# EAGLE design bottom20 (EAGLE 9.5.2)
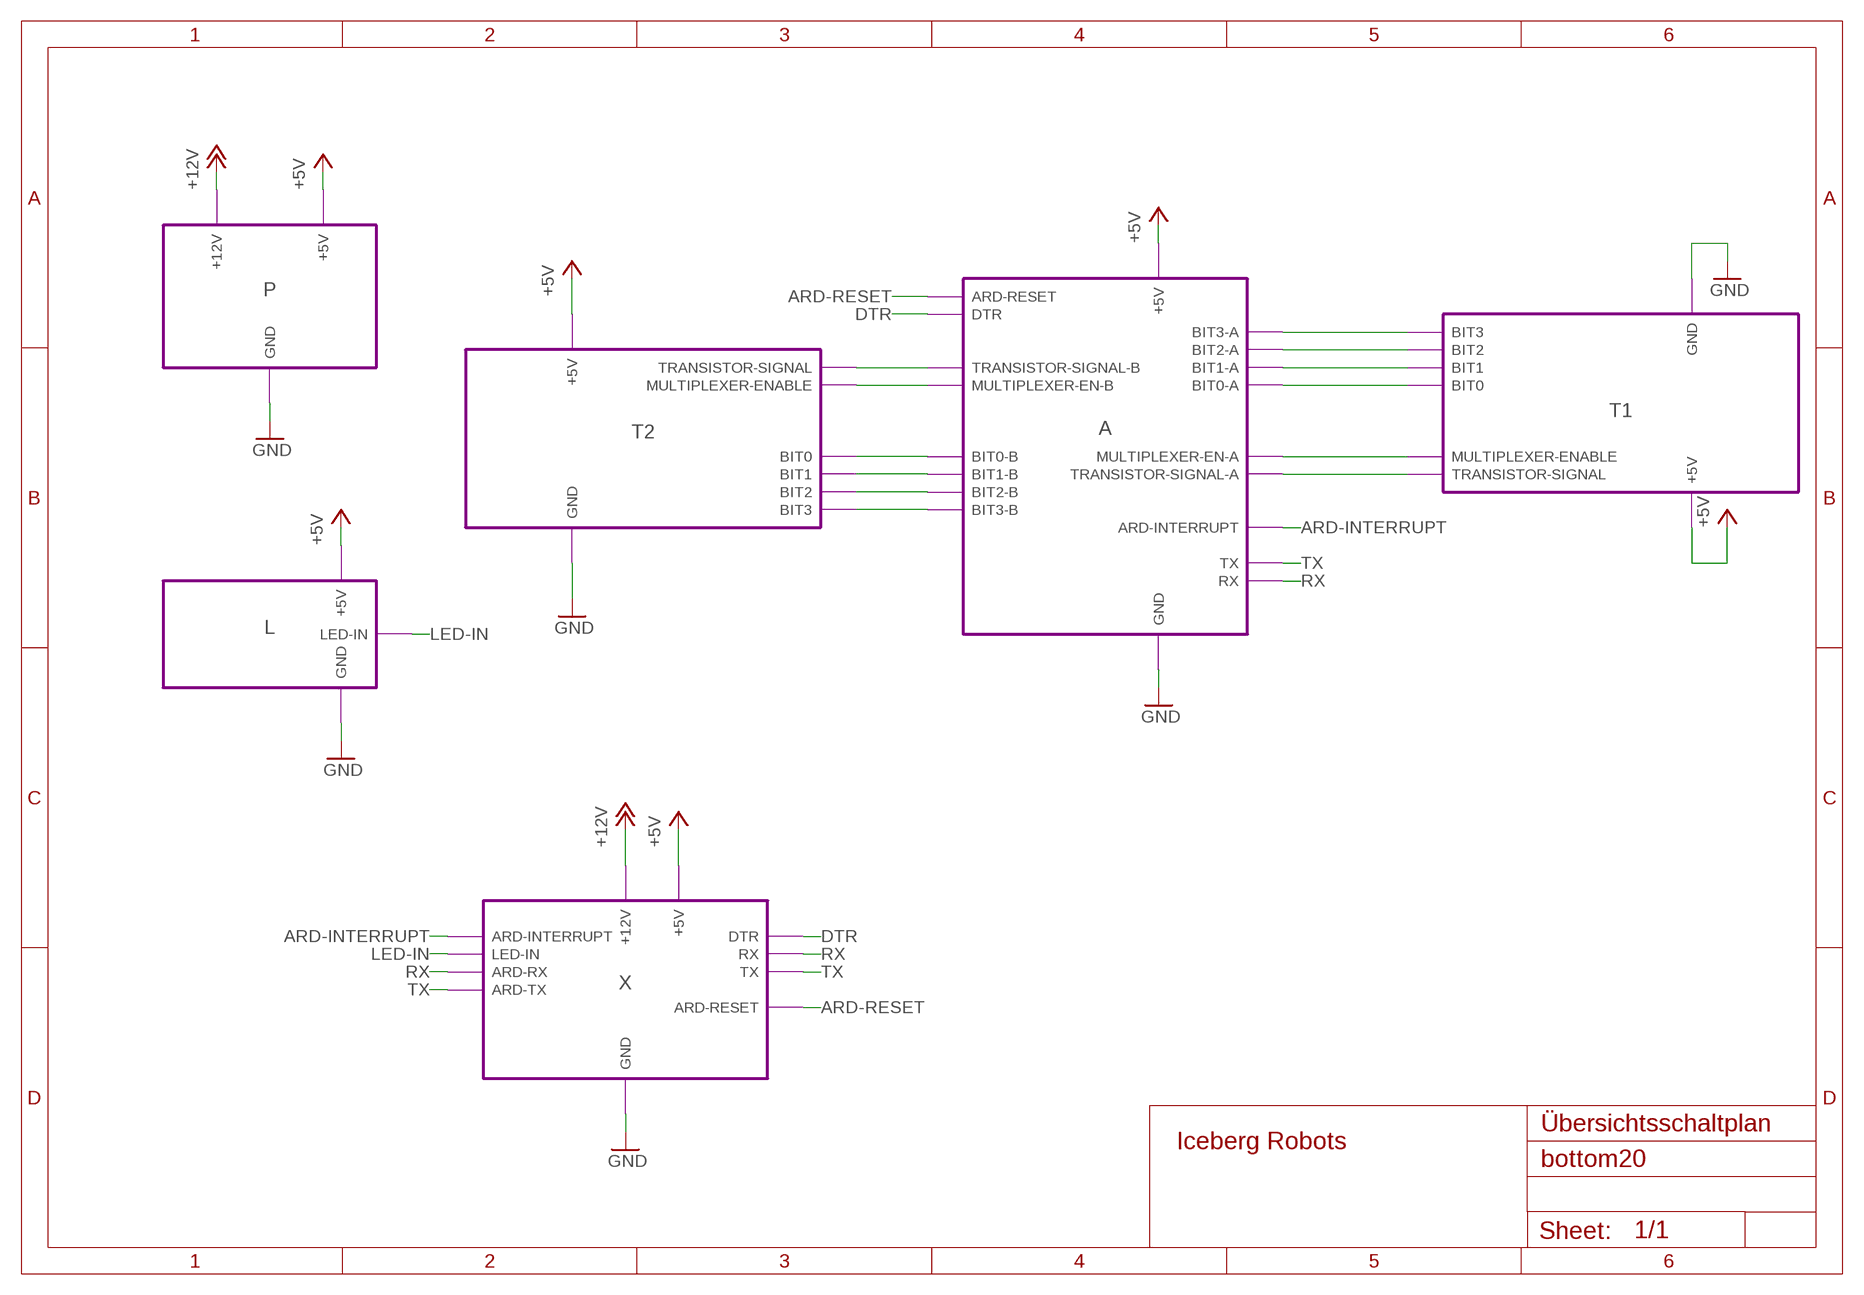
[diagram p0: schematic, sheet 1]

## Module instances
L = LED
X = ANSCHLUSS
A = ARDUINO
P = SCHALTREGLER
T1 = PHOTOTRANSISTOR
T2 = PHOTOTRANSISTOR

## Nets
+5V: port L.+5V T2.+5V T1.+5V A.+5V P.+5V X.+5V
+12V: port P.+12V X.+12V
ARD-INTERRUPT: port A.ARD-INTERRUPT X.ARD-INTERRUPT
ARD-RESET: port A.ARD-RESET X.ARD-RESET
DTR: port A.DTR X.DTR
GND: port L.GND X.GND A.GND P.GND T2.GND T1.GND
LED-IN: port X.LED-IN L.LED-IN
N$2: port T2.TRANSISTOR-SIGNAL A.TRANSISTOR-SIGNAL-B
N$3: port T2.MULTIPLEXER-ENABLE A.MULTIPLEXER-EN-B
N$4: port A.BIT0-B T2.BIT0
N$5: port A.BIT1-B T2.BIT1
N$6: port A.BIT2-B T2.BIT2
N$7: port A.BIT3-B T2.BIT3
N$8: port A.BIT3-A T1.BIT3
N$9: port A.BIT2-A T1.BIT2
N$10: port A.BIT1-A T1.BIT1
N$11: port A.BIT0-A T1.BIT0
N$12: port A.MULTIPLEXER-EN-A T1.MULTIPLEXER-ENABLE
N$13: port A.TRANSISTOR-SIGNAL-A T1.TRANSISTOR-SIGNAL
RX: port X.RX A.RX X.ARD-RX
TX: port X.TX A.TX X.ARD-TX

## Notes on the sheet
- Übersichtsschaltplan

## Library data of the parts

## Module LED
Ports: +5V(pwr) GND(pwr) LED-IN(in)
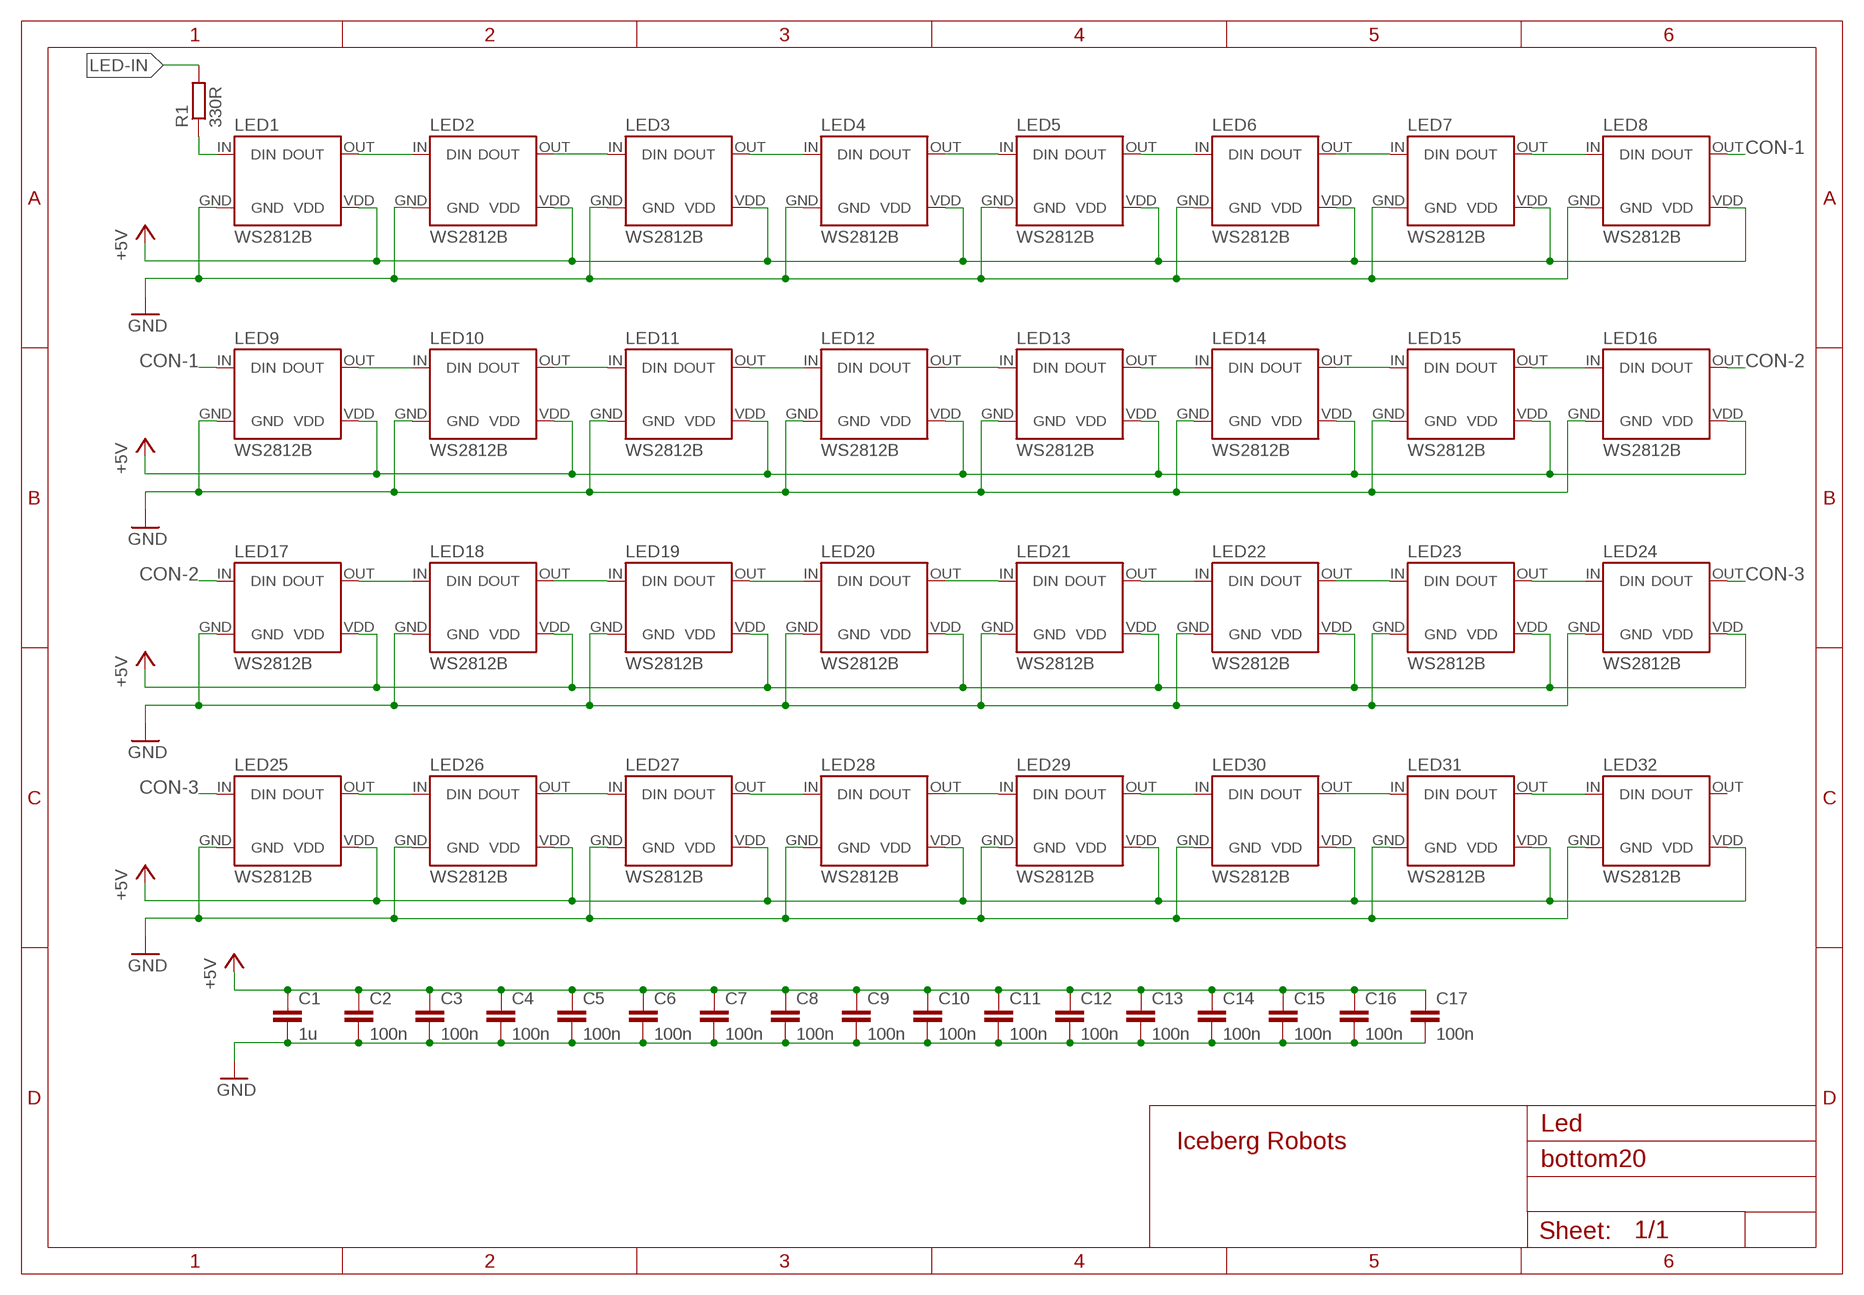
[diagram p1: schematic, module LED, sheet 1]

### Parts
C1  1u  C0805  [C0805]
C2  100n  C0805  [C0805]
C3  100n  C0805  [C0805]
C4  100n  C0805  [C0805]
C5  100n  C0805  [C0805]
C6  100n  C0805  [C0805]
C7  100n  C0805  [C0805]
C8  100n  C0805  [C0805]
C9  100n  C0805  [C0805]
C10  100n  C0805  [C0805]
C11  100n  C0805  [C0805]
C12  100n  C0805  [C0805]
C13  100n  C0805  [C0805]
C14  100n  C0805  [C0805]
C15  100n  C0805  [C0805]
C16  100n  C0805  [C0805]
C17  100n  C0805  [C0805]
LED1  WS2812B  [5050]
LED2  WS2812B  [5050]
LED3  WS2812B  [5050]
LED4  WS2812B  [5050]
LED5  WS2812B  [5050]
LED6  WS2812B  [5050]
LED7  WS2812B  [5050]
LED8  WS2812B  [5050]
LED9  WS2812B  [5050]
LED10  WS2812B  [5050]
LED11  WS2812B  [5050]
LED12  WS2812B  [5050]
LED13  WS2812B  [5050]
LED14  WS2812B  [5050]
LED15  WS2812B  [5050]
LED16  WS2812B  [5050]
LED17  WS2812B  [5050]
LED18  WS2812B  [5050]
LED19  WS2812B  [5050]
LED20  WS2812B  [5050]
LED21  WS2812B  [5050]
LED22  WS2812B  [5050]
LED23  WS2812B  [5050]
LED24  WS2812B  [5050]
LED25  WS2812B  [5050]
LED26  WS2812B  [5050]
LED27  WS2812B  [5050]
LED28  WS2812B  [5050]
LED29  WS2812B  [5050]
LED30  WS2812B  [5050]
LED31  WS2812B  [5050]
LED32  WS2812B  [5050]
R1  330R  R  [R0805]

### Nets
+5V: C1.1 C2.1 C3.1 C4.1 C5.1 C6.1 C7.1 C8.1 C9.1 C10.1 C11.1 C12.1 C13.1 C14.1 C15.1 C16.1 C17.1 LED1.VDD LED2.VDD LED3.VDD LED4.VDD LED5.VDD LED6.VDD LED7.VDD LED8.VDD LED9.VDD LED10.VDD LED11.VDD LED12.VDD LED13.VDD LED14.VDD LED15.VDD LED16.VDD LED17.VDD LED18.VDD LED19.VDD LED20.VDD LED21.VDD LED22.VDD LED23.VDD LED24.VDD LED25.VDD LED26.VDD LED27.VDD LED28.VDD LED29.VDD LED30.VDD LED31.VDD LED32.VDD
CON-1: LED8.OUT(DOUT) LED9.IN(DIN)
CON-2: LED16.OUT(DOUT) LED17.IN(DIN)
CON-3: LED24.OUT(DOUT) LED25.IN(DIN)
GND: C1.2 C2.2 C3.2 C4.2 C5.2 C6.2 C7.2 C8.2 C9.2 C10.2 C11.2 C12.2 C13.2 C14.2 C15.2 C16.2 C17.2 LED1.GND LED2.GND LED3.GND LED4.GND LED5.GND LED6.GND LED7.GND LED8.GND LED9.GND LED10.GND LED11.GND LED12.GND LED13.GND LED14.GND LED15.GND LED16.GND LED17.GND LED18.GND LED19.GND LED20.GND LED21.GND LED22.GND LED23.GND LED24.GND LED25.GND LED26.GND LED27.GND LED28.GND LED29.GND LED30.GND LED31.GND LED32.GND
LED-IN: R1.2
LED-IN1: LED2.OUT(DOUT) LED3.IN(DIN)
LED-IN2: LED4.OUT(DOUT) LED5.IN(DIN)
LED-IN3: LED6.OUT(DOUT) LED7.IN(DIN)
LED-IN4: LED26.OUT(DOUT) LED27.IN(DIN)
LED-IN5: LED10.OUT(DOUT) LED11.IN(DIN)
LED-IN6: LED12.OUT(DOUT) LED13.IN(DIN)
LED-IN7: LED14.OUT(DOUT) LED15.IN(DIN)
LED-IN8: LED28.OUT(DOUT) LED29.IN(DIN)
LED-IN9: LED18.OUT(DOUT) LED19.IN(DIN)
LED-IN10: LED20.OUT(DOUT) LED21.IN(DIN)
LED-IN11: LED22.OUT(DOUT) LED23.IN(DIN)
LED-IN12: LED30.OUT(DOUT) LED31.IN(DIN)
N$1: LED3.OUT(DOUT) LED4.IN(DIN)
N$2: LED1.OUT(DOUT) LED2.IN(DIN)
N$3: LED25.OUT(DOUT) LED26.IN(DIN)
N$4: LED5.OUT(DOUT) LED6.IN(DIN)
N$5: LED27.OUT(DOUT) LED28.IN(DIN)
N$6: LED29.OUT(DOUT) LED30.IN(DIN)
N$7: LED7.OUT(DOUT) LED8.IN(DIN)
N$8: LED31.OUT(DOUT) LED32.IN(DIN)
N$9: LED9.OUT(DOUT) LED10.IN(DIN)
N$10: LED1.IN(DIN) R1.1
N$11: LED11.OUT(DOUT) LED12.IN(DIN)
N$12: LED13.OUT(DOUT) LED14.IN(DIN)
N$13: LED15.OUT(DOUT) LED16.IN(DIN)
N$14: LED17.OUT(DOUT) LED18.IN(DIN)
N$16: LED19.OUT(DOUT) LED20.IN(DIN)
N$17: LED21.OUT(DOUT) LED22.IN(DIN)
N$18: LED23.OUT(DOUT) LED24.IN(DIN)
Unconnected: LED32.OUT(DOUT)

### Notes on the sheet
- Led

### Library data of the parts
C1-C17 = iceberg20:C: Capacitor, SMD 0805, Value wird festgelegt; BESTAND: -; HERSTELLER: -; HERSTELLER-NR: -; SUPPLIER: -; SUPPLIER-NR: -; TOLERANZ: 10%; V-MAX: 20V
LED1-LED32 = iceberg20:WS2812B: SMD RGB LED Datenblatt: Link <https://cdn-shop.adafruit.com/datasheets/WS2812B.pdf>; BESTAND: ?; HERSTELLER: SparkFun Electronics; HERSTELLER-NR: COM-13667; SUPPLIER: Mouser; SUPPLIER-NR: 474-COM-13667
R1 = iceberg20:R: Resistor, SMD 0805, Value wird festgelegt; BESTAND: -; HERSTELLER: -; HERSTELLER-NR: -; SUPPLIER: -; SUPPLIER-NR: -; TOLERANZ: 5%

## Module PHOTOTRANSISTOR
Ports: +5V(pwr) GND(pwr) MULTIPLEXER-ENABLE(in) TRANSISTOR-SIGNAL(out) BIT0(in) BIT1(in) BIT2(in) BIT3(in)
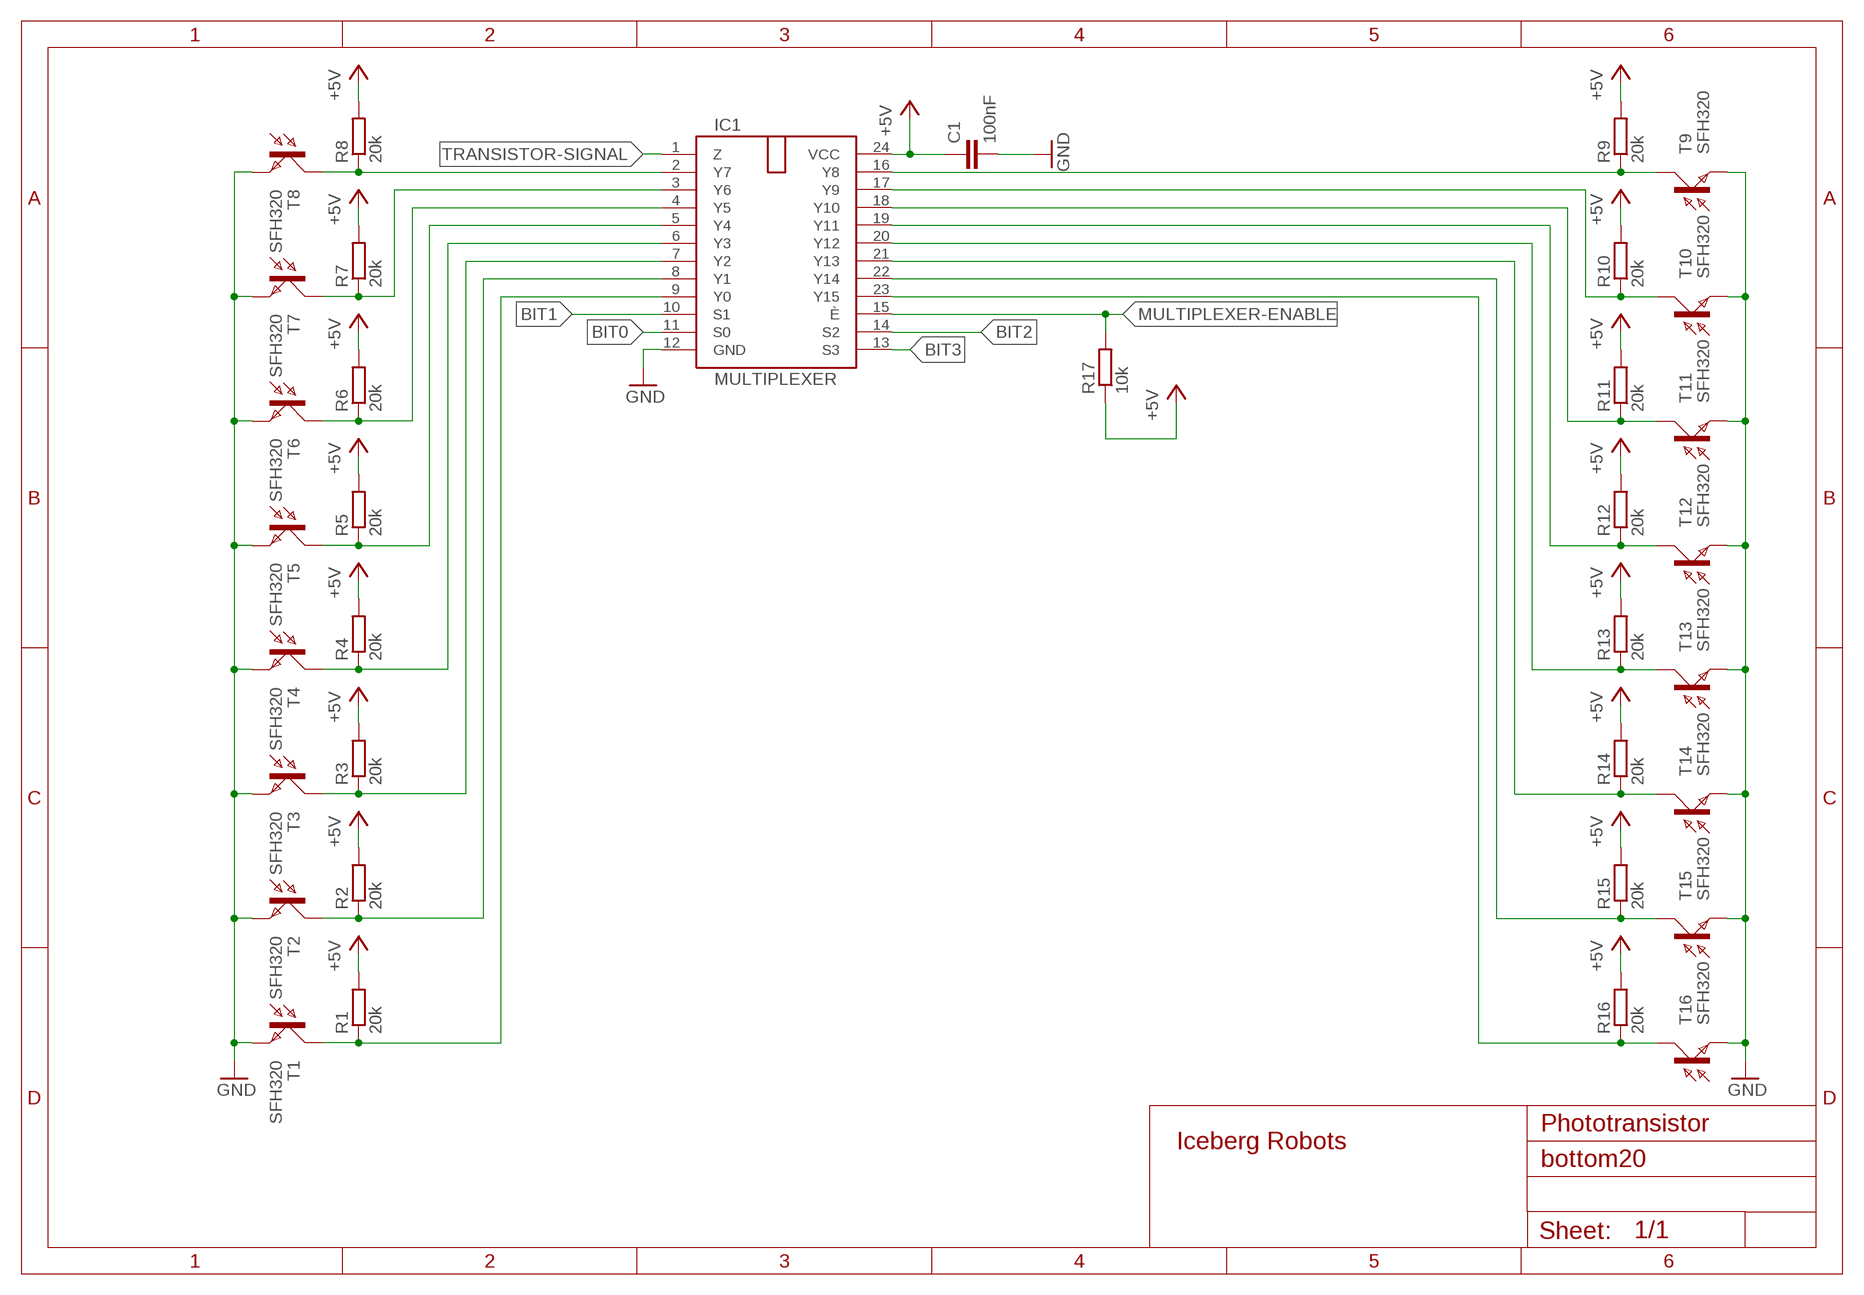
[diagram p2: schematic, module PHOTOTRANSISTOR, sheet 1]

### Parts
C1  100nF  C0805  [C0805]
IC1  MULTIPLEXER  [SO24]
R1  20k  R  [R0805]
R2  20k  R  [R0805]
R3  20k  R  [R0805]
R4  20k  R  [R0805]
R5  20k  R  [R0805]
R6  20k  R  [R0805]
R7  20k  R  [R0805]
R8  20k  R  [R0805]
R9  20k  R  [R0805]
R10  20k  R  [R0805]
R11  20k  R  [R0805]
R12  20k  R  [R0805]
R13  20k  R  [R0805]
R14  20k  R  [R0805]
R15  20k  R  [R0805]
R16  20k  R  [R0805]
R17  10k  R  [R0805]
T1  SFH320  [PLCC-2]
T2  SFH320  [PLCC-2]
T3  SFH320  [PLCC-2]
T4  SFH320  [PLCC-2]
T5  SFH320  [PLCC-2]
T6  SFH320  [PLCC-2]
T7  SFH320  [PLCC-2]
T8  SFH320  [PLCC-2]
T9  SFH320  [PLCC-2]
T10  SFH320  [PLCC-2]
T11  SFH320  [PLCC-2]
T12  SFH320  [PLCC-2]
T13  SFH320  [PLCC-2]
T14  SFH320  [PLCC-2]
T15  SFH320  [PLCC-2]
T16  SFH320  [PLCC-2]

### Nets
+5V: C1.1 IC1.24(VCC) R1.2 R2.2 R3.2 R4.2 R5.2 R6.2 R7.2 R8.2 R9.2 R10.2 R11.2 R12.2 R13.2 R14.2 R15.2 R16.2 R17.1
BIT0: IC1.11(S0)
BIT1: IC1.10(S1)
BIT2: IC1.14(S2)
BIT3: IC1.13(S3)
GND: C1.2 IC1.12(GND) T1.C(E) T2.C(E) T3.C(E) T4.C(E) T5.C(E) T6.C(E) T7.C(E) T8.C(E) T9.C(E) T10.C(E) T11.C(E) T12.C(E) T13.C(E) T14.C(E) T15.C(E) T16.C(E)
MULTIPLEXER-ENABLE: IC1.15(È) R17.2
N$1: IC1.9(Y0) R1.1 T1.A(C)
N$2: IC1.8(Y1) R2.1 T2.A(C)
N$3: IC1.7(Y2) R3.1 T3.A(C)
N$4: IC1.6(Y3) R4.1 T4.A(C)
N$5: IC1.5(Y4) R5.1 T5.A(C)
N$7: IC1.16(Y8) R9.1 T9.A(C)
N$9: IC1.2(Y7) R8.1 T8.A(C)
N$10: IC1.3(Y6) R7.1 T7.A(C)
N$11: IC1.4(Y5) R6.1 T6.A(C)
N$12: IC1.17(Y9) R10.1 T10.A(C)
N$14: IC1.18(Y10) R11.1 T11.A(C)
N$18: IC1.20(Y12) R13.1 T13.A(C)
N$20: IC1.21(Y13) R14.1 T14.A(C)
N$22: IC1.22(Y14) R15.1 T15.A(C)
N$25: IC1.23(Y15) R16.1 T16.A(C)
N$26: IC1.19(Y11) R12.1 T12.A(C)
TRANSISTOR-SIGNAL: IC1.1(Z)

### Notes on the sheet
- Phototransistor

### Library data of the parts
C1 = iceberg20:C: Capacitor, SMD 0805, Value wird festgelegt; BESTAND: -; HERSTELLER: -; HERSTELLER-NR: -; SUPPLIER: -; SUPPLIER-NR: -; TOLERANZ: 10%; V-MAX: 20V
IC1 = iceberg20:MULTIPLEXER: NEXPERIA 74HC4067D IC: digital; Demultiplexer/ Multiplexer; Kanäle: 16; SMD; SO24 Datenblatt: Link <https://www.tme.eu/Document/f7469e4262be23b806ff9ce642496e1e/74HC4067D.pdf>; BESTAND: ?; HERSTELLER: NEXPERIA; HERSTELLER-NR: 74HC4067D; SUPPLIER: TME; SUPPLIER-NR: 74HC4067D
R1-R17 = iceberg20:R: Resistor, SMD 0805, Value wird festgelegt; BESTAND: -; HERSTELLER: -; HERSTELLER-NR: -; SUPPLIER: -; SUPPLIER-NR: -; TOLERANZ: 5%
T1-T16 = iceberg20:SFH320: SFH 320-Z, 5V, 450 - 1150 nm Datenblatt: Link <https://www.osram.com/ecat/TOPLED%c2%ae%20SFH%20320/com/en/class_pim_web_catalog_103489/global/prd_pim_device_2219665/>; BESTAND: 40; HERSTELLER: Osram Opto Semi; HESTELLER-NR: SFH320; SUPLLIER: Bürklin; SUPPLIER-NR: 68S3158

## Module ARDUINO
Ports: +5V(pwr) GND(pwr) RX(in) TX(out) TRANSISTOR-SIGNAL-B(in) MULTIPLEXER-EN-B(out) BIT0-B(out) BIT1-B(out) BIT2-B(out) BIT3-B(out) BIT0-A(out) BIT2-A(out) BIT1-A(out) BIT3-A(out) MULTIPLEXER-EN-A(out) TRANSISTOR-SIGNAL-A(in) ARD-RESET(in) DTR(in) ARD-INTERRUPT(out)
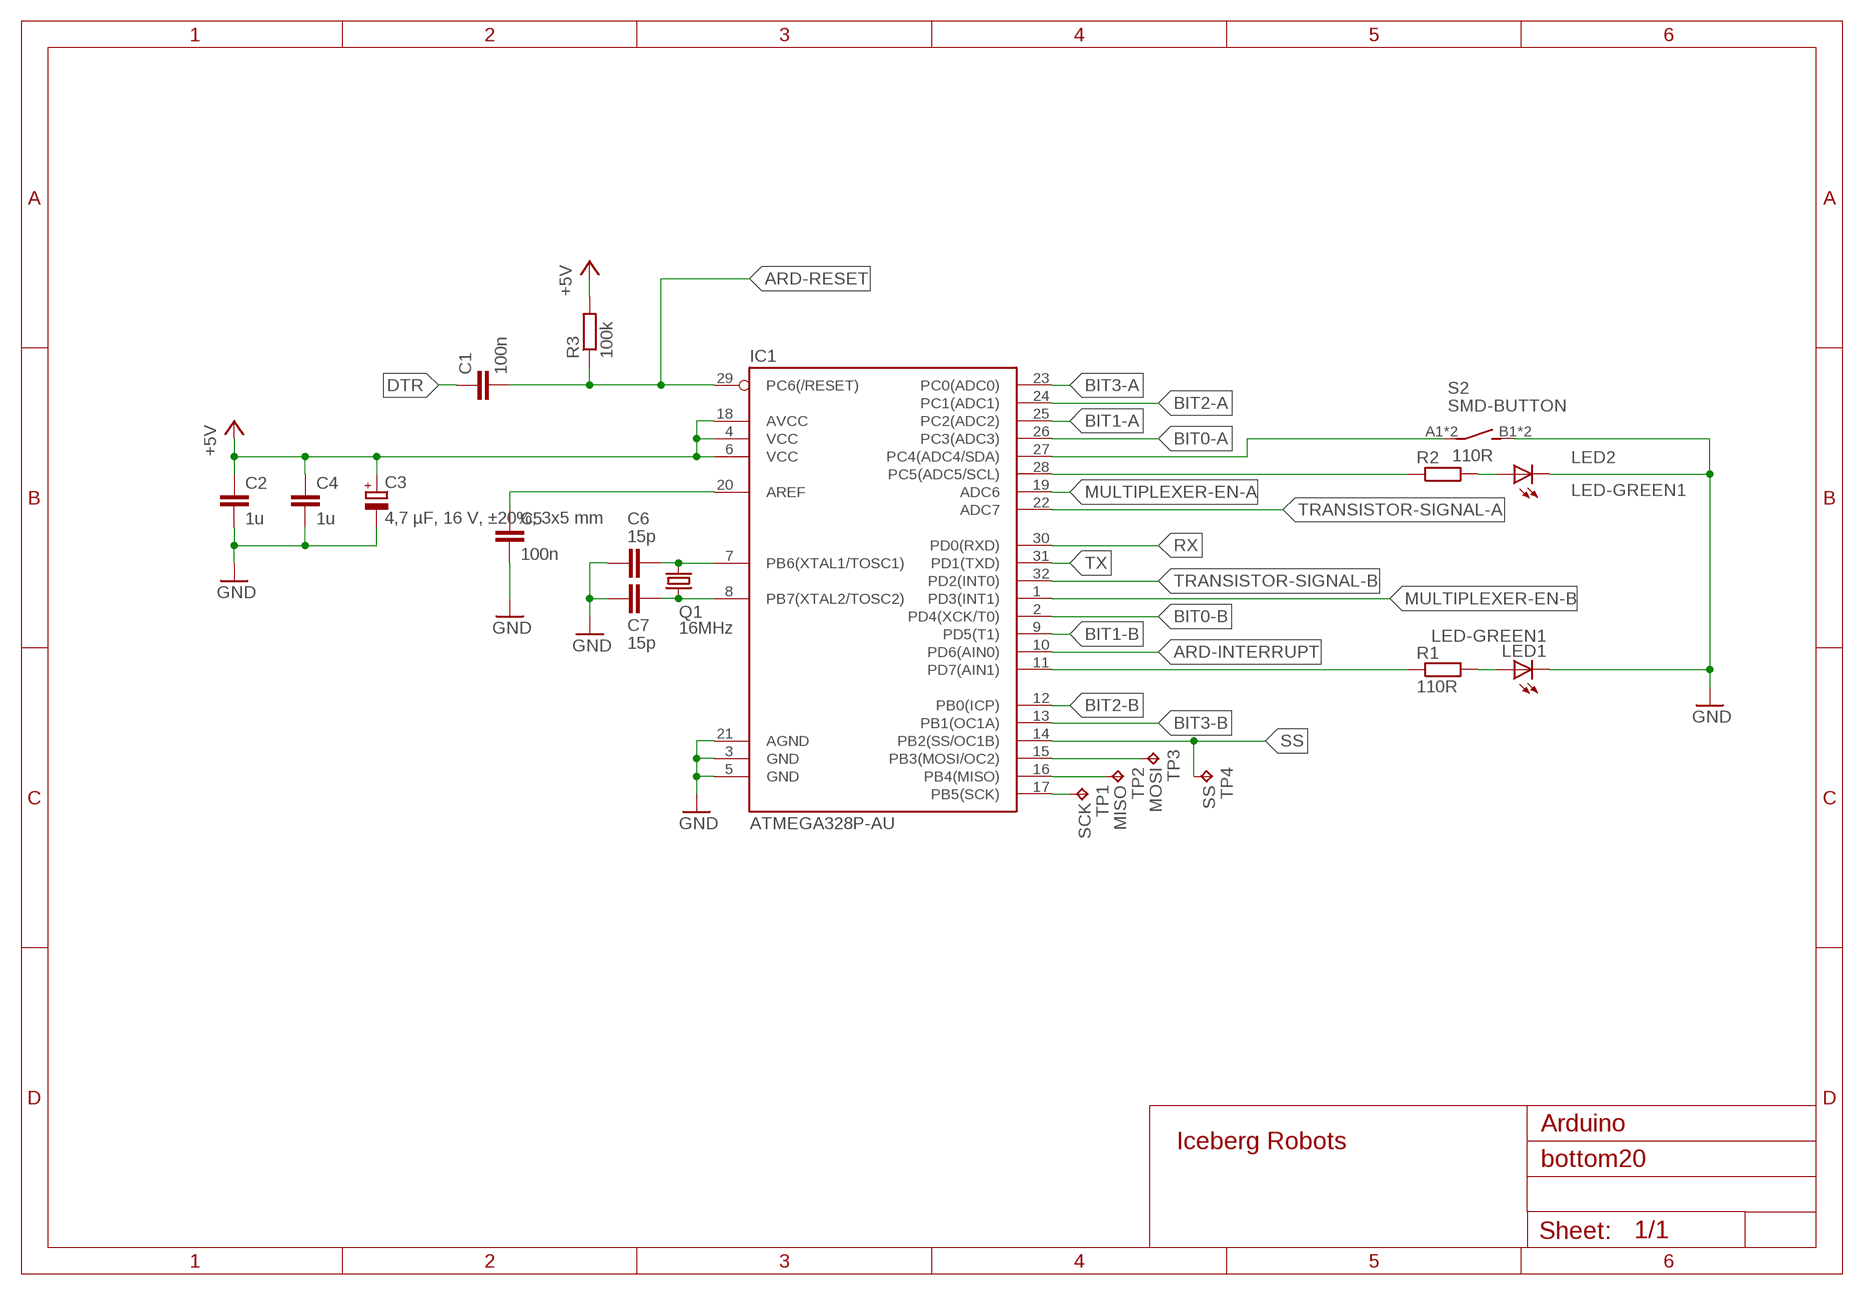
[diagram p3: schematic, module ARDUINO, sheet 1]

### Parts
C1  100n  C0805  [C0805]
C2  1u  C0805  [C0805]
C3  4,7 µF, 16 V, ±20%, 3x5 mm  ELKO-THT-4,7UF  [CAPACITOR-THT-3]
C4  1u  C0805  [C0805]
C5  100n  C0805  [C0805]
C6  15p  C0805  [C0805]
C7  15p  C0805  [C0805]
IC1  ATMEGA328P-AU  [ATMEGA328P-AU]
LED1  LED-GREEN1  [1206]
LED2  LED-GREEN1  [1206]
Q1  16MHz  CRYSTAL  [CRYSTAL_HC49U-V]
R1  110R  R  [R0805]
R2  110R  R  [R0805]
R3  100k  R  [R0805]
S2  SMD-BUTTON  [SWITCH-6MM-SMD]
TP1  SCK  TESTPAD  [TESTPAD_B2,54]
TP2  MISO  TESTPAD  [TESTPAD_B2,54]
TP3  MOSI  TESTPAD  [TESTPAD_B2,54]
TP4  SS  TESTPAD  [TESTPAD_B2,54]

### Nets
+5V: C2.1 C3.1(+) C4.1 IC1.4(VCC) IC1.6(VCC) IC1.18(AVCC) R3.2
ARD-INTERRUPT: IC1.10(PD6(AIN0))
ARD-RESET: C1.2 IC1.29(PC6(/RESET)) R3.1
BIT0-A: IC1.26(PC3(ADC3))
BIT0-B: IC1.2(PD4(XCK/T0))
BIT1-A: IC1.25(PC2(ADC2))
BIT1-B: IC1.9(PD5(T1))
BIT2-A: IC1.24(PC1(ADC1))
BIT2-B: IC1.12(PB0(ICP))
BIT3-A: IC1.23(PC0(ADC0))
BIT3-B: IC1.13(PB1(OC1A))
DTR: C1.1
GND: C2.2 C3.2(-) C4.2 C5.2 C6.1 C7.2 IC1.3(GND) IC1.5(GND) IC1.21(AGND) LED1.C LED2.C S2.B1(S) S2.B2(S)
MISO: IC1.16(PB4(MISO)) TP2.TP
MOSI: IC1.15(PB3(MOSI/OC2)) TP3.TP
MULTIPLEXER-EN-A: IC1.19(ADC6)
MULTIPLEXER-EN-B: IC1.1(PD3(INT1))
N$1: IC1.11(PD7(AIN1)) R1.1
N$2: C7.1 IC1.8(PB7(XTAL2/TOSC2)) Q1.1
N$3: C6.2 IC1.7(PB6(XTAL1/TOSC1)) Q1.2
N$4: LED1.A R1.2
N$8: C5.1 IC1.20(AREF)
N$9: IC1.27(PC4(ADC4/SDA)) S2.A1(P) S2.A2(P)
N$10: LED2.A R2.2
N$11: IC1.28(PC5(ADC5/SCL)) R2.1
RX: IC1.30(PD0(RXD))
SCK: IC1.17(PB5(SCK)) TP1.TP
SS: IC1.14(PB2(SS/OC1B)) TP4.TP
TRANSISTOR-SIGNAL-A: IC1.22(ADC7)
TRANSISTOR-SIGNAL-B: IC1.32(PD2(INT0))
TX: IC1.31(PD1(TXD))

### Notes on the sheet
- Arduino

### Library data of the parts
C1 C2 C4-C7 = iceberg20:C: Capacitor, SMD 0805, Value wird festgelegt; BESTAND: -; HERSTELLER: -; HERSTELLER-NR: -; SUPPLIER: -; SUPPLIER-NR: -; TOLERANZ: 10%; V-MAX: 20V
C3 = iceberg20:ELKO: Aluminium-Elko 4,7 µF, 16 V, ±20%, 3x5 mm Datenblatt: Link <https://https://www.buerklin.com/medias/sys_master/root/hc1/h62/8875244388382/8875244388382.pdf>; BESTAND: ?; HERSTELLER: NICHICON; HERSTELLER-NR: UMA1C4R7MCD2TP; SUPPLIER: Bürklin; SUPPLIER-NR: 58D5274
IC1 = iceberg20:ATMEGA328P-AU: 8bit MCU ATMEGA328P-AU Datenblatt: Link <https://www.buerklin.com/medias/sys_master/root/hfb/h24/8879331508254/8879331508254.pdf>; BESTAND: 0; HERSTELLER: Microchip; HERSTELLER-NR: ATMEGA328PAU; SUPPLIER: Bürklin; SUPPLIER-NR: 64S4010
LED1 LED2 = iceberg20:LED-GREEN1: LED Green, 1206Datenblatt: Link <https://www.buerklin.com/medias/sys_master/root/h40/hdf/8866310357022/8866310357022.pdf>; HERSTELLER: EVERLIGHT; HERSTELLER-NR: 15-21SYGC/S530-E1/TR8 Everlight; SUPPLIER: Bürklin; SUPPLIER-NR: 67S2004
Q1 = iceberg20:CRYSTAL: Quarz, 16 MHz, 18 pF, ±30 ppm Datenblatt: Link <https://www.buerklin.com/medias/sys_master/root/h75/hc8/8866448998430/8866448998430.pdf>; BESTAND: ?; HERSTELLER: Mercury; HERSTELLER-NR: HUS-16.000-18-30/50/4085; SUPPLIER: Bürklin; SUPPLIER-NR: 78D428
R1-R3 = iceberg20:R: Resistor, SMD 0805, Value wird festgelegt; BESTAND: -; HERSTELLER: -; HERSTELLER-NR: -; SUPPLIER: -; SUPPLIER-NR: -; TOLERANZ: 5%
S2 = iceberg20:SMD-BUTTON: SMD-Button, 6mm x 6mm Datenblatt: Link <https://www.buerklin.com/medias/sys_master/root/h03/h3f/8877444497438/8877444497438.pdf>; BESTAND: 0; HERSTELLER: Alcoswitch; HERSTELLER-NR: 4-1437565-1 FSM4JSMA; SUPPLIER: Bürklin; SUPPLIER-NR: 12G482
TP1-TP4 = iceberg20:TESTPAD: Testpad; BESTAND: -; HERSTELLER: -; HERSTELLER-NR: -; SUPPLIER: -; SUPPLIER-NR: -

## Module ANSCHLUSS
Ports: GND(pwr) DTR(out) RX(out) TX(in) ARD-RESET(out) ARD-RX(out) ARD-TX(in) +5V(pwr) +12V(pwr) ARD-INTERRUPT(in) LED-IN(out)
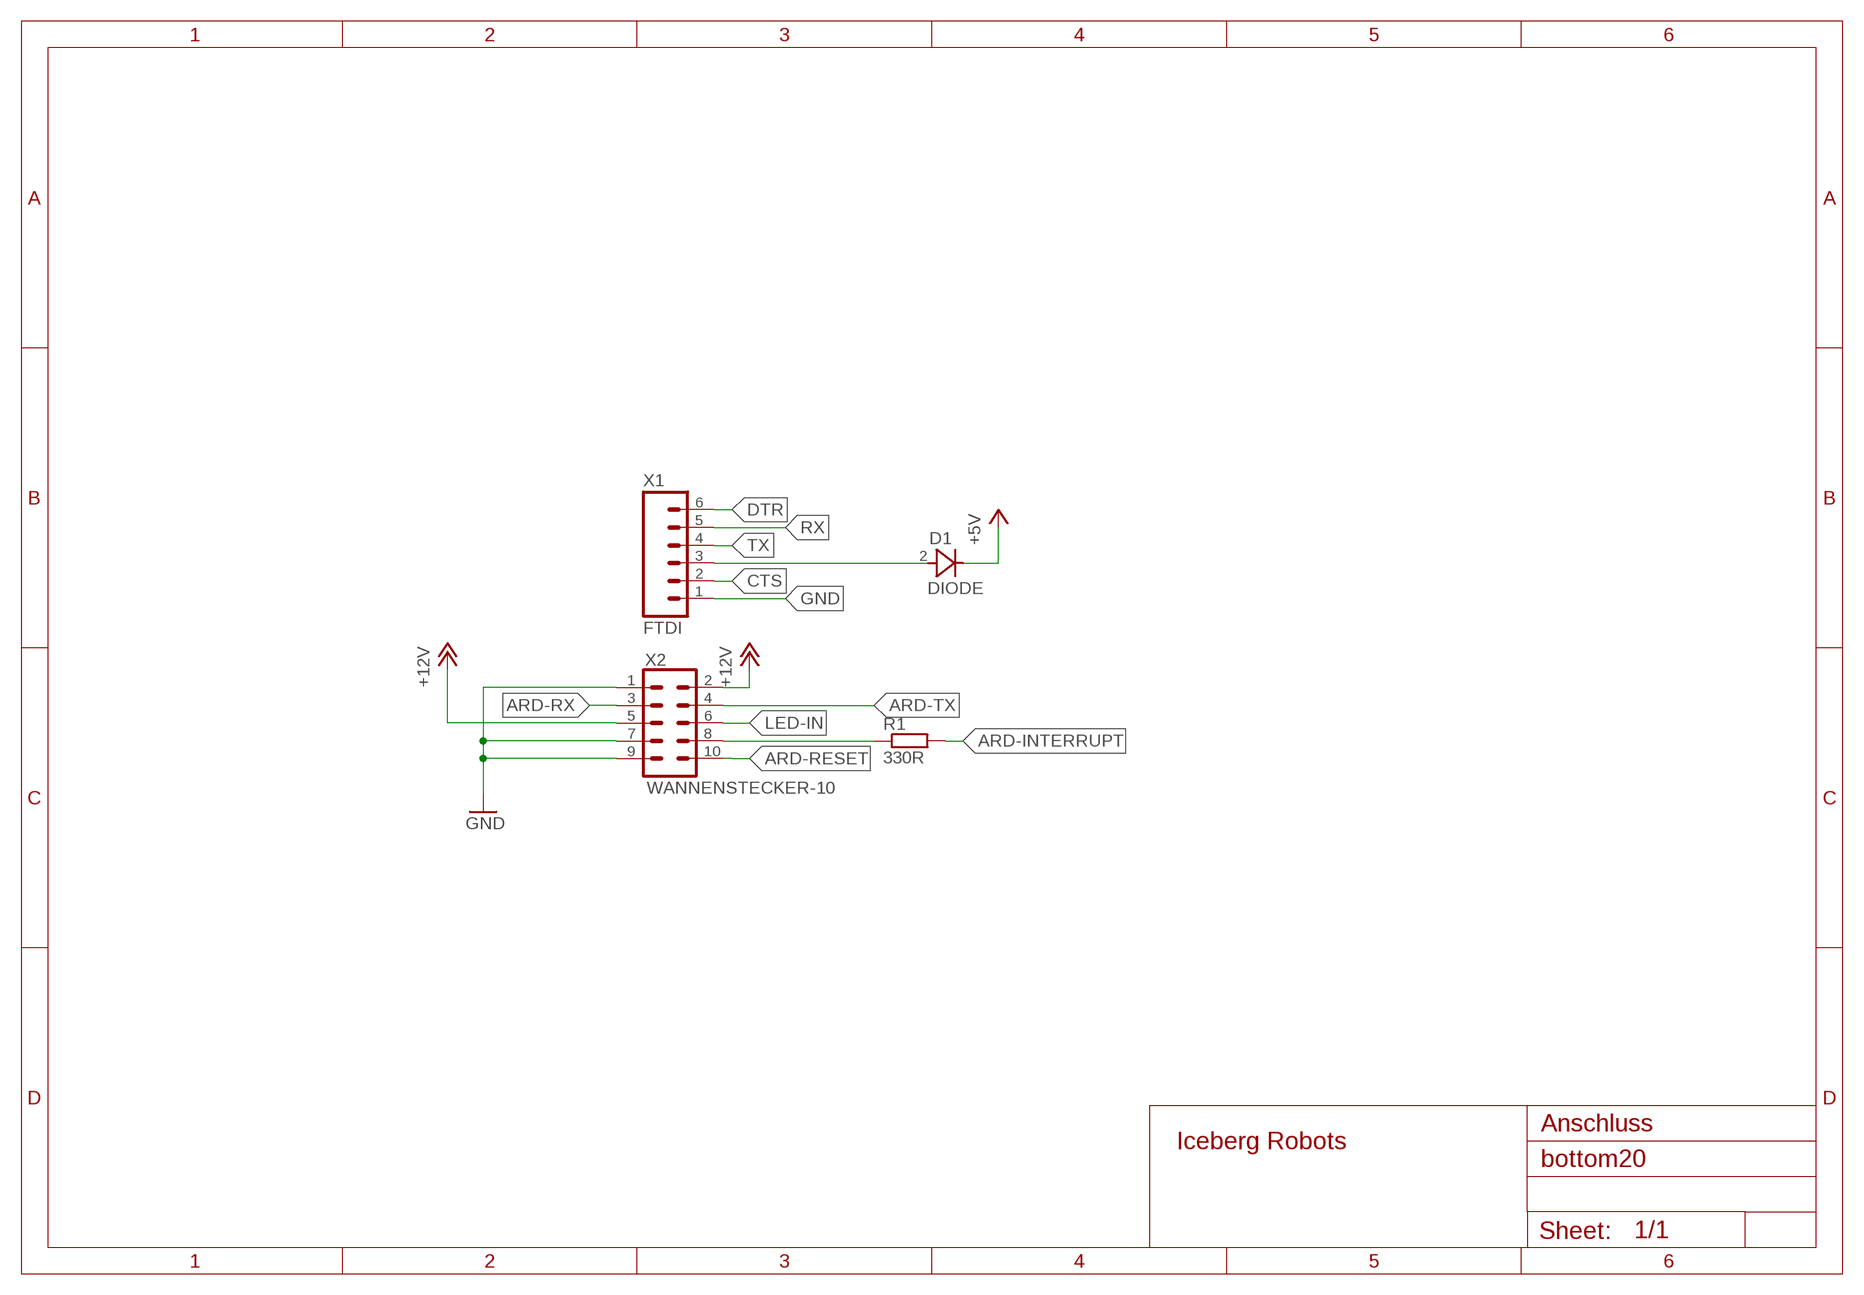
[diagram p4: schematic, module ANSCHLUSS, sheet 1]

### Parts
D1  DIODE  [DO-214BA]
R1  330R  R  [R0805]
X1  FTDI  BUCHSENLEISTE-6-ANGLED  [PIN-HEADER-ANGLED-6]
X2  WANNENSTECKER-10  [2X5-SHROUDED]

### Nets
+5V: D1.1(C)
+12V: X2.2 X2.5
ARD-INTERRUPT: R1.2
ARD-RESET: X2.10
ARD-RX: X2.3
ARD-TX: X2.4
CTS: X1.2
DTR: X1.6
GND: X1.1 X2.1 X2.7 X2.9
LED-IN: X2.6
N$1: R1.1 X2.8
RX: X1.5
TX: X1.4
VID: D1.2(A) X1.3

### Notes on the sheet
- Anschluss

### Library data of the parts
D1 = iceberg20:DIODE: SMD-Gleichrichter-Diode, 50 V, 1 A, DO214BA Datenblatt: Link <https://www.buerklin.com/medias/sys_master/root/h18/hbc/8865944993822/8865944993822.pdf>; BESTAND: 0; HERSTELLER: Vishay; HERSTELLER-NR: 9DRGF1A67A; SUPPLIER: Bürklin; SUPPLIER-NR: 26S9150
R1 = iceberg20:R: Resistor, SMD 0805, Value wird festgelegt; BESTAND: -; HERSTELLER: -; HERSTELLER-NR: -; SUPPLIER: -; SUPPLIER-NR: -; TOLERANZ: 5%
X1 = iceberg20:BUCHSENLEISTE-6-ANGLED: BL 1X20W 2,54 20-pin socket terminal strip, angled, RM 2.54 Datenblatt: Link <https://cdn-reichelt.de/documents/datenblatt/C140/DATENBLATT_NBLA.pdf>; BESTAND: ?; SUPPLIER: Reichelt; SUPPLIER-NR: BL 1X20W 2,54
X2 = iceberg20:WANNENSTECKER-10: Stiftleiste Stift, 10-polig Harting 09185106324 Datenblatt: Link <https://www.buerklin.com/medias/sys_master/root/h85/hc4/9017036046366/TDS-HARTING-Harting-EN-1571996484089.pdf> Zeichnung: Link <https://www.buerklin.com/medias/sys_master/root/hcd/h46/8866195374110/8866195374110.pdf>; BESTAND: ?; HERSTELLER: Harting; HERSTELLER-NR: 09 18 510 6324; SUPPLIER: Bürklin; SUPPLIER-NR: 53F4205

## Module SCHALTREGLER
Ports: +12V(in) +5V(out) GND(pwr)
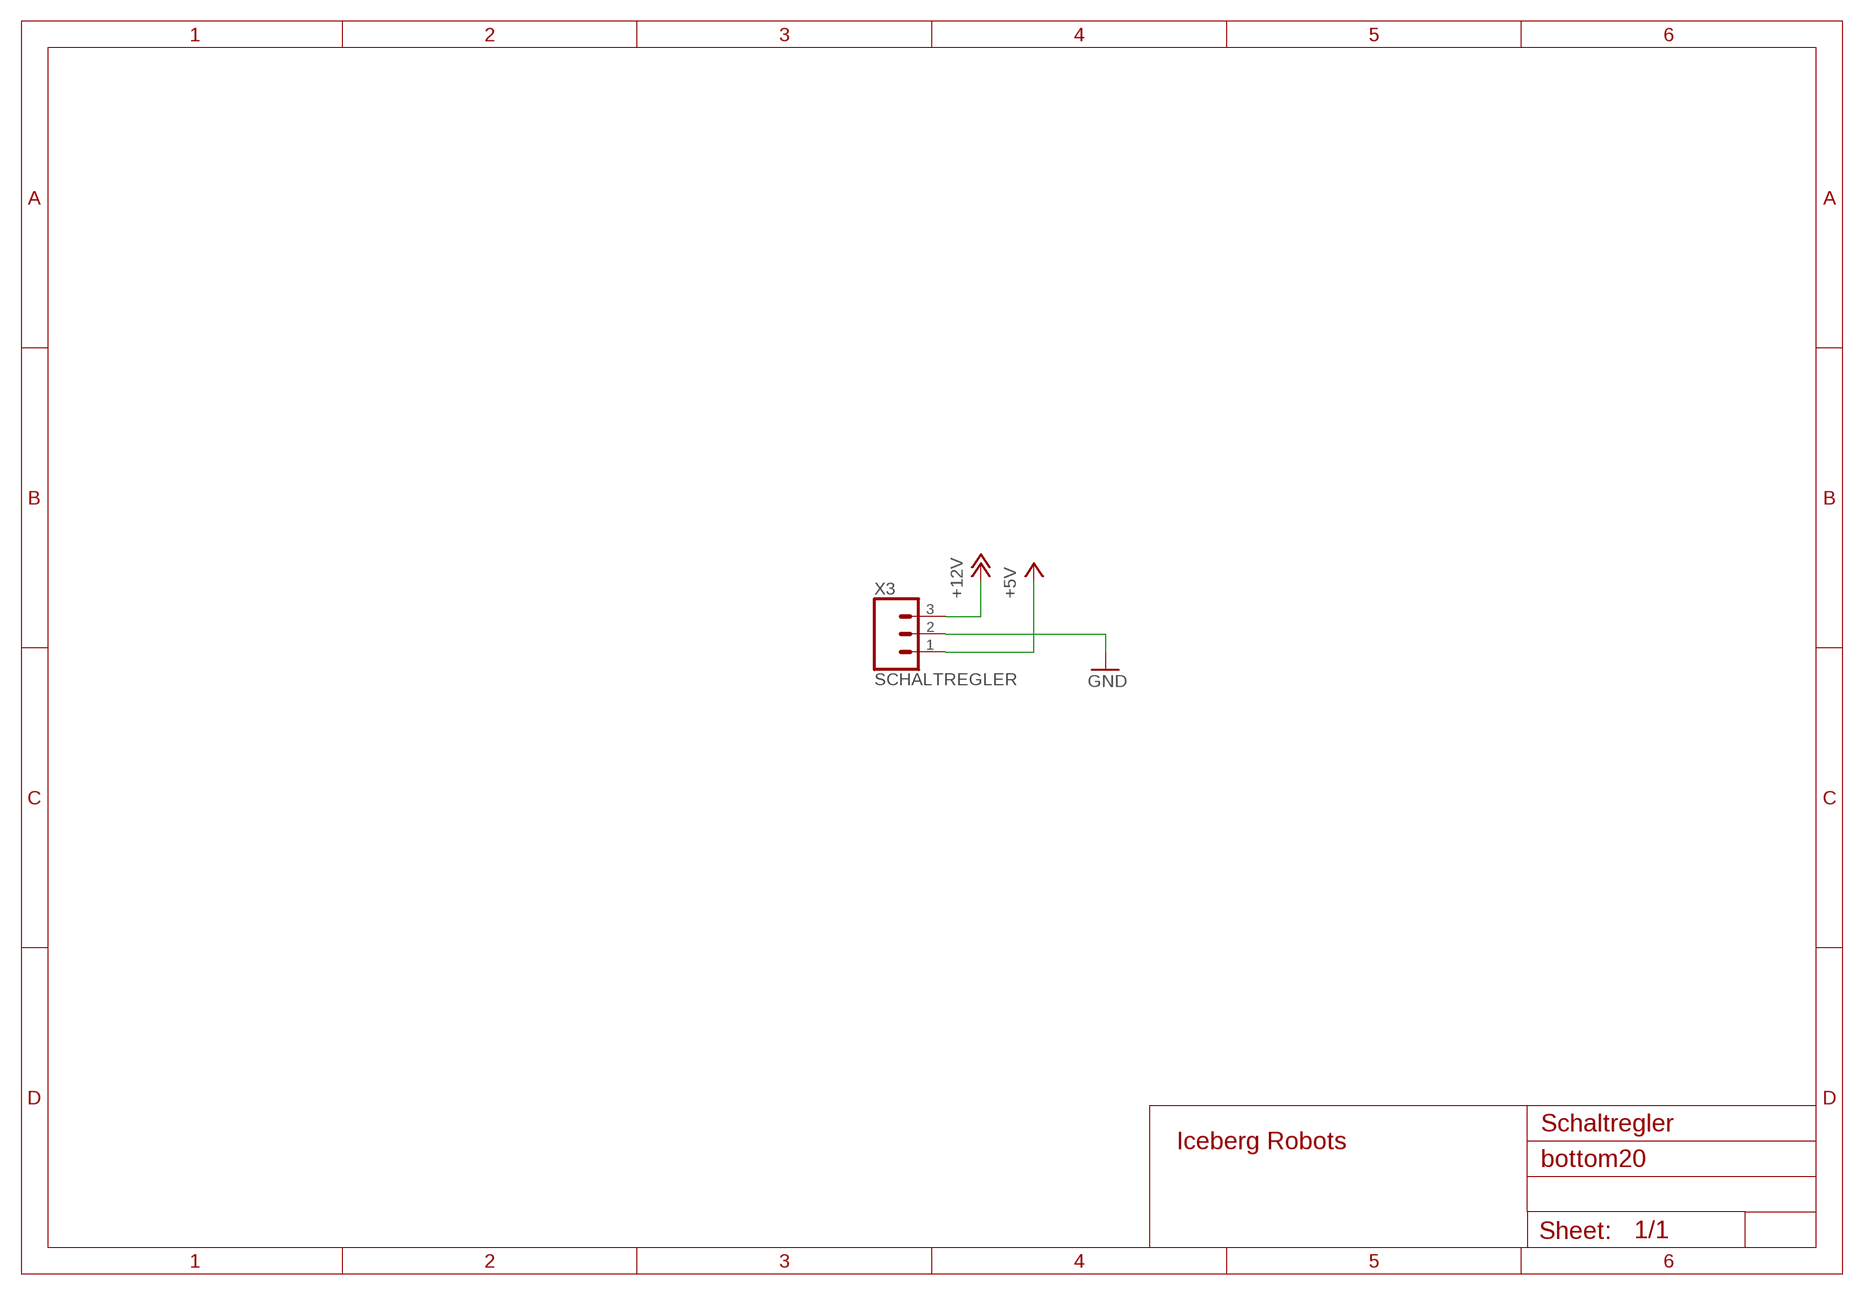
[diagram p5: schematic, module SCHALTREGLER, sheet 1]

### Parts
X3  SCHALTREGLER  HOLE-01X03  [3X1]

### Nets
+5V: X3.1
+12V: X3.3
GND: X3.2

### Notes on the sheet
- Schaltregler

### Library data of the parts
X3 = iceberg20:HOLE-01X03: Plated Through Hole - 3Pin

## Net classes
0 default: width 0.254 mm

## Board
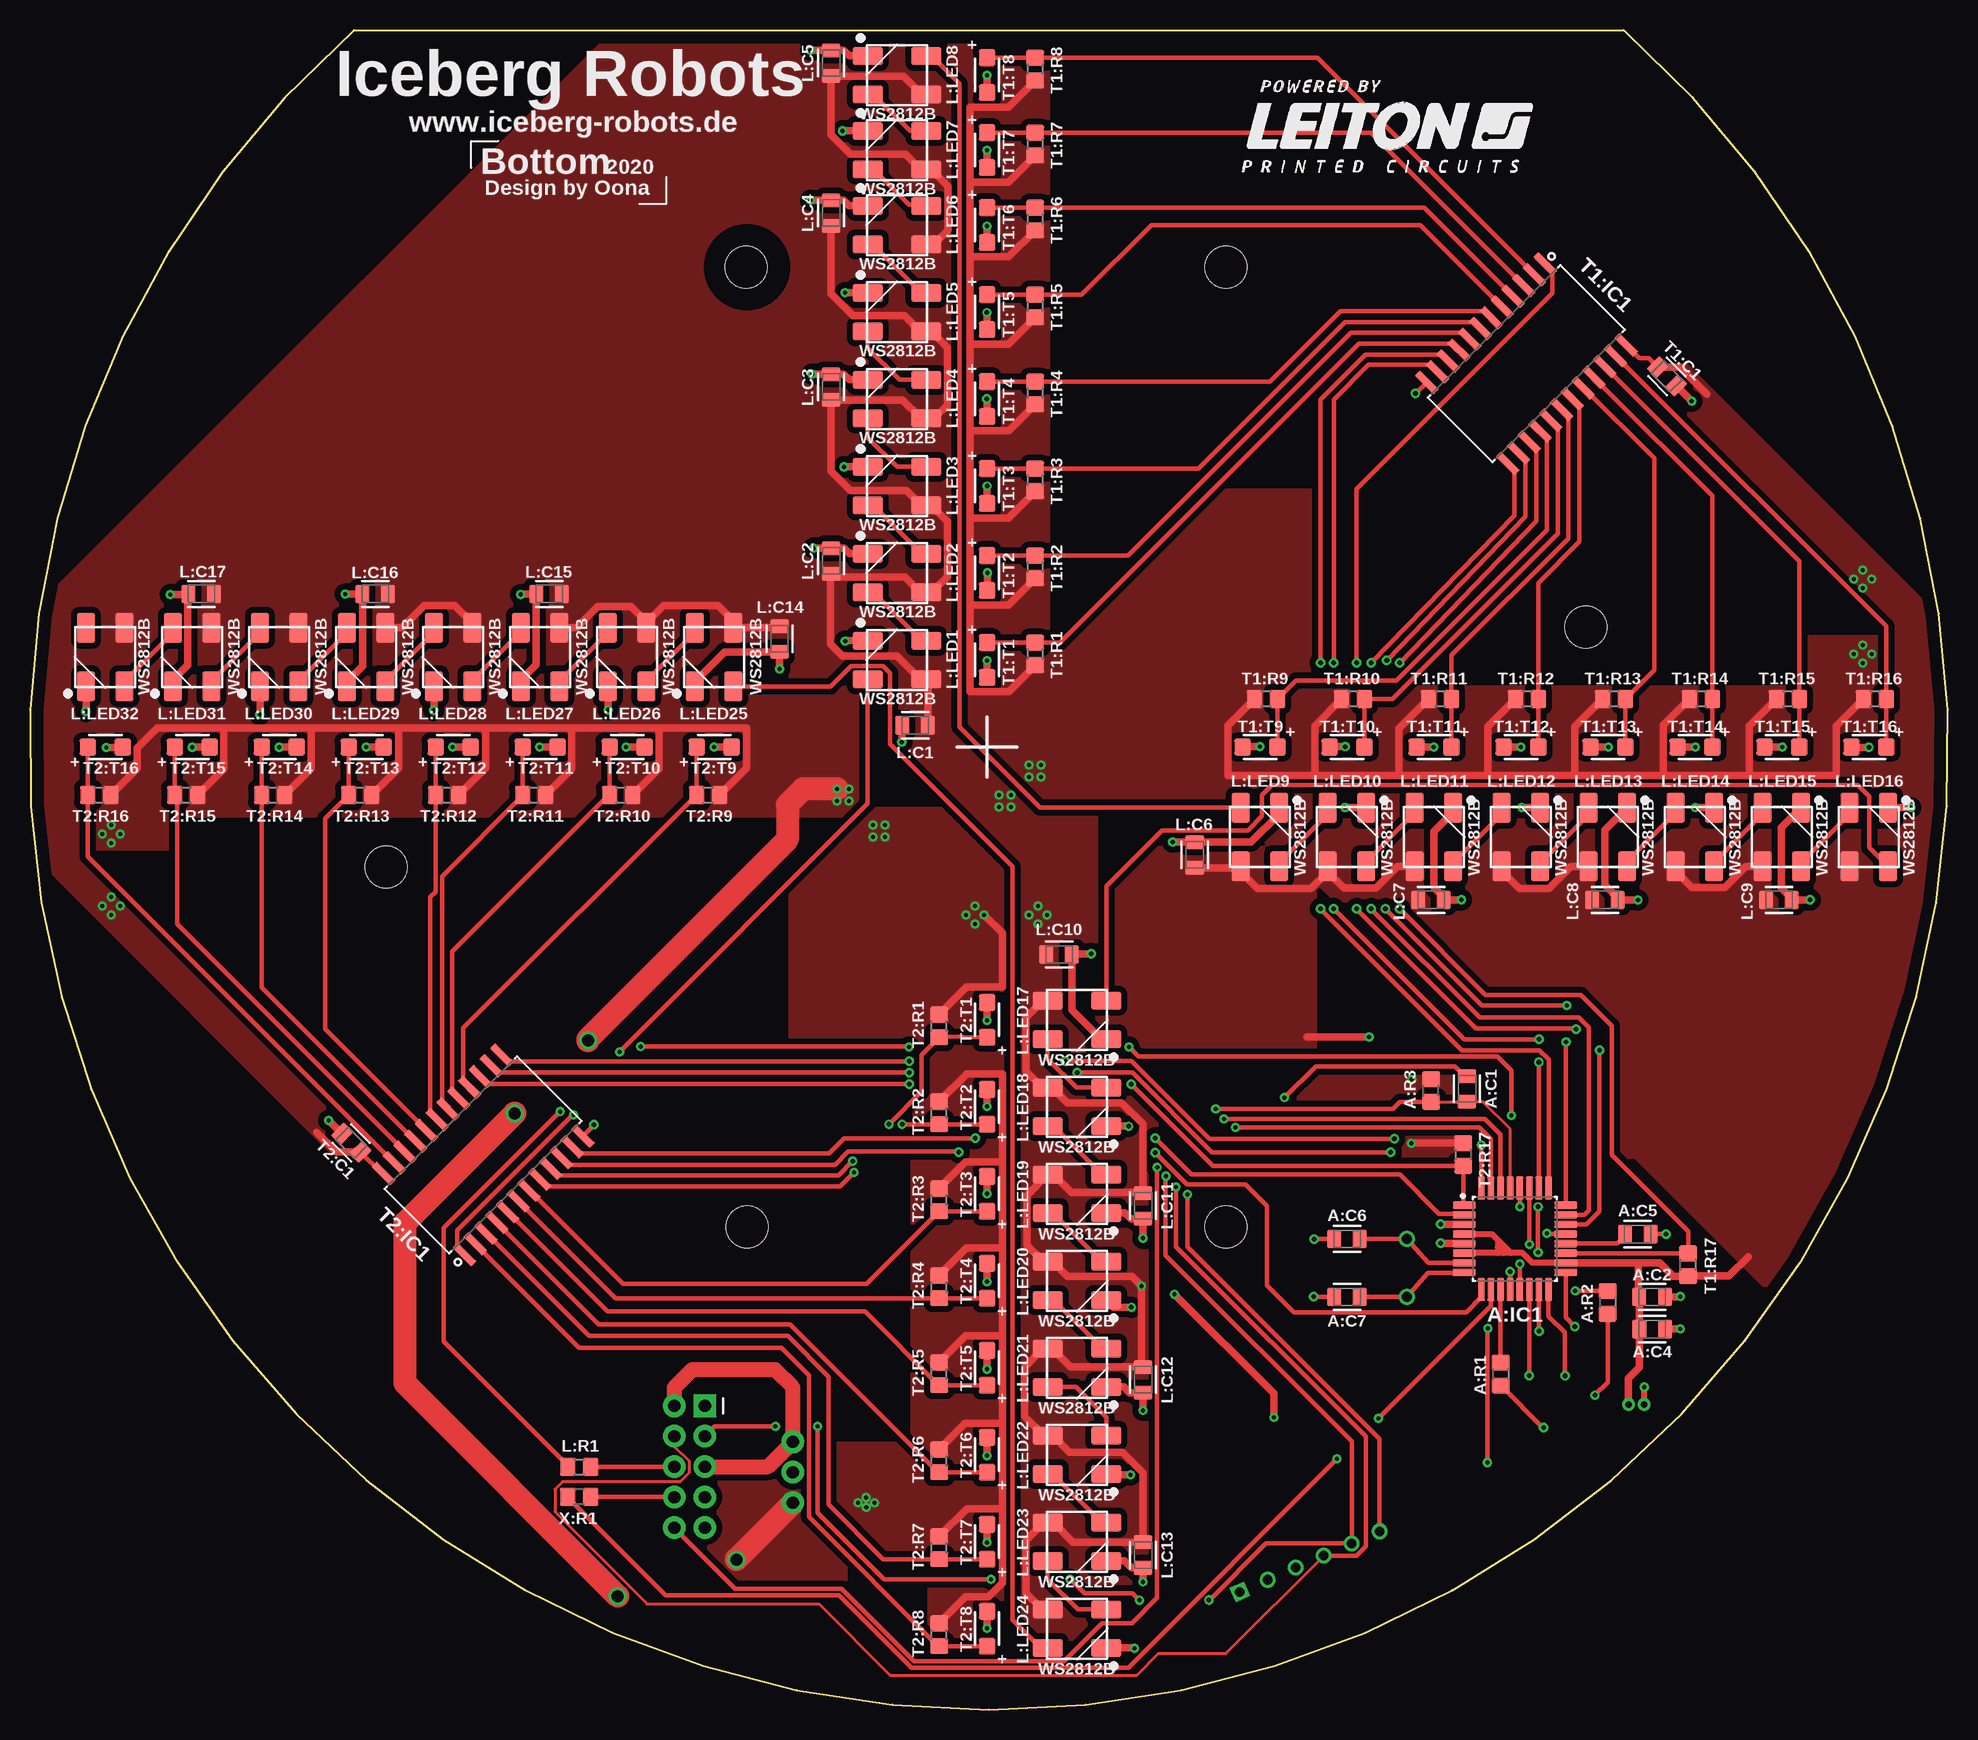
[diagram p6: board, top side]
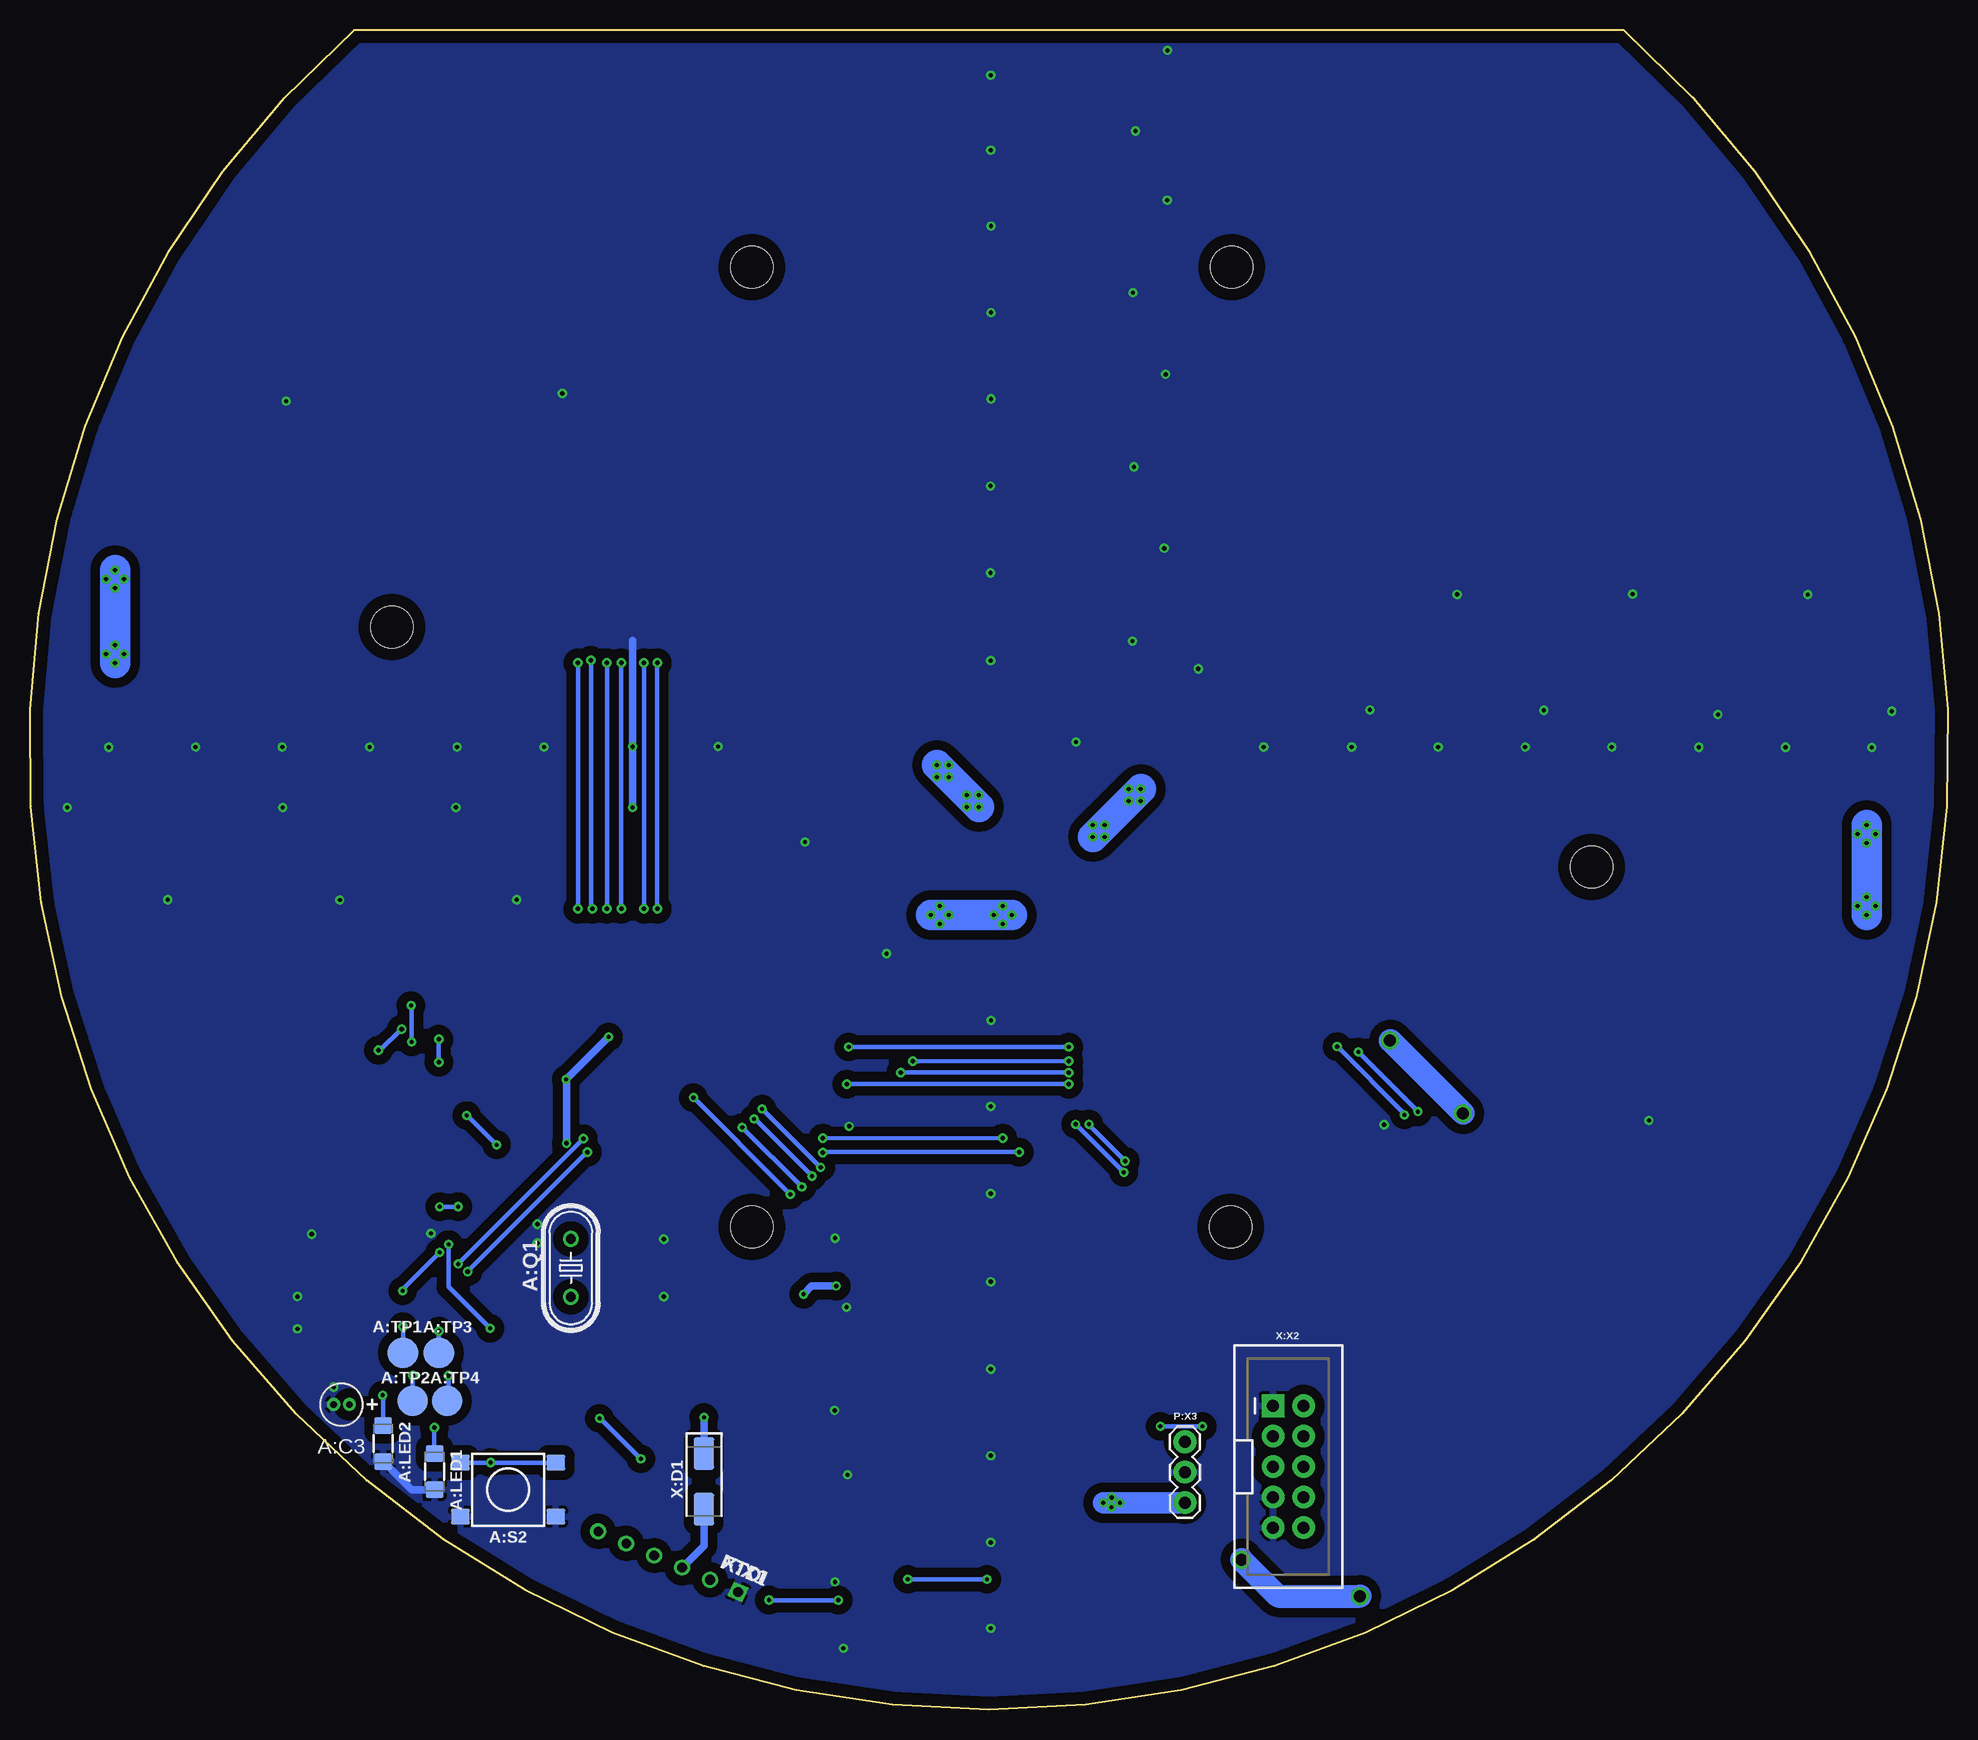
[diagram p7: board, bottom side, seen from below]

Size 159.86 x 140 mm. Coordinates in mm from the lower left corner, seen from the top.
Outline: 27.02,140 arc277 132.85,140 27.02,140
Copper layers (1*16): Top 0.035mm / dielectric 0.15mm / Bottom 0.035mm
Design rules "default *": minimum track width 6mil, minimum drill 0.35mm, track to track 6mil, track to pad 6mil, pad to pad 6mil, via to via 6mil, smd to smd 6mil, copper to edge 40mil, drill to drill 6mil, minimum pad ring 10mil, minimum via ring 8mil, stop-mask expansion 4mil, vias tented up to drill 20mil, thermal gap 10mil
Holes 3.5 mm at 99.7,120.23 59.7,120.23 99.7,40.23 129.7,90.23 59.78,40.23 29.7,70.23
tRestrict: area 26.3,66.7 to 33.3,73.7; area 56.8,37.2 to 62.8,43.2; area 96.8,37.2 to 102.8,43.2; area 126.3,86.7 to 133.3,93.7; area 96.8,117.2 to 102.8,123.2; area 56.8,117.2 to 62.8,123.2

### Footprints (pad centres in the part's own frame; a part is rotated, then mirrored left to right if it is on the bottom)
C0805 = smd 1.172 x 1.565: 1 -1.072,0; 2 1.072,0
CAPACITOR-THT-3 = drill 0.55 pad 1.05: 1 -0.65,0; 2 0.65,0
ATMEGA328P-AU = smd 1.9 x 0.587: 1 -4.231,2.8; 2 -4.231,2; 3 -4.231,1.2; 4 -4.231,0.4; 5 -4.231,-0.4; 6 -4.231,-1.2; 7 -4.231,-2; 8 -4.231,-2.8; 17 4.231,-2.8; 18 4.231,-2; 19 4.231,-1.2; 20 4.231,-0.4; 21 4.231,0.4; 22 4.231,1.2; 23 4.231,2; 24 4.231,2.8 | smd 0.587 x 1.9: 9 -2.8,-4.231; 10 -2,-4.231; 11 -1.2,-4.231; 12 -0.4,-4.231; 13 0.4,-4.231; 14 1.2,-4.231; 15 2,-4.231; 16 2.8,-4.231; 25 2.8,4.231; 26 2,4.231; 27 1.2,4.231; 28 0.4,4.231; 29 -0.4,4.231; 30 -1.2,4.231; 31 -2,4.231; 32 -2.8,4.231
1206 = smd 1.4 x 1.5: A -1.5,0; C 1.5,0
CRYSTAL_HC49U-V = drill 0.813: 1 -2.413,0; 2 2.413,0
R0805 = smd 1.3 x 1.5: 1 -0.95,0; 2 0.95,0
SWITCH-6MM-SMD = smd 1.55 x 1.3: A1 -3.975,-2.25; A2 3.975,-2.25; B1 -3.975,2.25; B2 3.975,2.25
TESTPAD_B2,54 = smd 2.54 x 2.54: TP 0,0
5050 = smd 2.5 x 1.5: GND 2.45,-1.6; IN 2.45,1.6; OUT -2.45,-1.6; VDD -2.45,1.6
3X1 = drill 1.016 pad 1.88: 1 0,0; 2 2.54,0; 3 5.08,0
SO24 = smd 2.216 x 0.631: 1 -4.772,6.985; 2 -4.772,5.715; 3 -4.772,4.445; 4 -4.772,3.175; 5 -4.772,1.905; 6 -4.772,0.635; 7 -4.772,-0.635; 8 -4.772,-1.905; 9 -4.772,-3.175; 10 -4.772,-4.445; 11 -4.772,-5.715; 12 -4.772,-6.985; 13 4.772,-6.985; 14 4.772,-5.715; 15 4.772,-4.445; 16 4.772,-3.175; 17 4.772,-1.905; 18 4.772,-0.635; 19 4.772,0.635; 20 4.772,1.905; 21 4.772,3.175; 22 4.772,4.445; 23 4.772,5.715; 24 4.772,6.985
PLCC-2 = smd 1.4 x 1.4: A -1.45,0; C 1.45,0
DO-214BA = smd 2.716 x 1.709: 1 -2.316,0; 2 2.316,0
PIN-HEADER-ANGLED-6 = drill 0.8 square: 1 1.75,0.25 | drill 0.8: 2 4.29,0.25; 3 6.83,0.25; 4 9.37,0.25; 5 11.91,0.25; 6 14.45,0.25
2X5-SHROUDED = drill 1.016 pad 1.88 square: 1 -1.27,5.08 | drill 1.016 pad 1.88: 2 1.27,5.08; 3 -1.27,2.54; 4 1.27,2.54; 5 -1.27,0; 6 1.27,0; 7 -1.27,-2.54; 8 1.27,-2.54; 9 -1.27,-5.08; 10 1.27,-5.08

### Placement (x,y rotation side)
A:C1  100n  [C0805]  119.78,51.73 270 top
A:C2  1u  [C0805]  135.21,34.4 0 top
A:C3  4,7 µF, 16 V, ±20%, 3x5 mm  [CAPACITOR-THT-3]  133.9,25.43 180 bottom
A:C4  1u  [C0805]  135.22,31.7 0 top
A:C5  100n  [C0805]  134.01,39.63 0 top
A:C6  15p  [C0805]  109.78,39.23 0 top
A:C7  15p  [C0805]  109.78,34.4 180 top
A:IC1  ATMEGA328P-AU  [ATMEGA328P-AU]  123.78,39.23 0 top
A:LED1  LED-GREEN1  [1206]  126.14,19.83 270 bottom
A:LED2  LED-GREEN1  [1206]  130.42,22.16 270 bottom
A:Q1  16MHz  [CRYSTAL_HC49U-V]  114.78,36.81 90 bottom
A:R1  110R  [R0805]  122.58,27.96 270 top
A:R2  110R  [R0805]  131.5,33.93 270 top
A:R3  100k  [R0805]  116.78,51.59 90 top
A:S2  SMD-BUTTON  [SWITCH-6MM-SMD]  120.01,18.33 180 bottom
A:TP1  SCK  [TESTPAD_B2,54]  128.78,29.73 0 bottom
A:TP2  MISO  [TESTPAD_B2,54]  127.98,25.73 0 bottom
A:TP3  MOSI  [TESTPAD_B2,54]  125.78,29.73 0 bottom
A:TP4  SS  [TESTPAD_B2,54]  125.08,25.73 0 bottom
L:C1  1u  [C0805]  73.78,82.03 180 top
L:C2  100n  [C0805]  66.78,95.73 90 top
L:C3  100n  [C0805]  66.78,110.23 90 top
L:C4  100n  [C0805]  66.78,124.73 90 top
L:C5  100n  [C0805]  66.78,137.23 90 top
L:C6  100n  [C0805]  97.08,71.23 90 top
L:C7  100n  [C0805]  116.78,67.48 0 top
L:C8  100n  [C0805]  131.28,67.48 0 top
L:C9  100n  [C0805]  145.78,67.48 0 top
L:C10  100n  [C0805]  85.78,62.93 0 top
L:C11  100n  [C0805]  92.78,41.98 270 top
L:C12  100n  [C0805]  92.78,27.48 270 top
L:C13  100n  [C0805]  92.78,12.88 270 top
L:C14  100n  [C0805]  62.48,89.23 270 top
L:C15  100n  [C0805]  43.28,92.98 180 top
L:C16  100n  [C0805]  28.78,92.98 180 top
L:C17  100n  [C0805]  14.28,92.98 180 top
L:LED1  WS2812B  [5050]  72.28,87.48 180 top
L:LED2  WS2812B  [5050]  72.28,94.73 180 top
L:LED3  WS2812B  [5050]  72.28,101.98 180 top
L:LED4  WS2812B  [5050]  72.28,109.23 180 top
L:LED5  WS2812B  [5050]  72.28,116.48 180 top
L:LED6  WS2812B  [5050]  72.28,123.73 180 top
L:LED7  WS2812B  [5050]  72.28,129.98 180 top
L:LED8  WS2812B  [5050]  72.28,136.23 180 top
L:LED9  WS2812B  [5050]  102.53,72.73 90 top
L:LED10  WS2812B  [5050]  109.78,72.73 90 top
L:LED11  WS2812B  [5050]  117.03,72.73 90 top
L:LED12  WS2812B  [5050]  124.28,72.73 90 top
L:LED13  WS2812B  [5050]  131.53,72.73 90 top
L:LED14  WS2812B  [5050]  138.78,72.73 90 top
L:LED15  WS2812B  [5050]  146.03,72.73 90 top
L:LED16  WS2812B  [5050]  153.28,72.73 90 top
L:LED17  WS2812B  [5050]  87.28,57.48 0 top
L:LED18  WS2812B  [5050]  87.28,50.23 0 top
L:LED19  WS2812B  [5050]  87.28,42.98 0 top
L:LED20  WS2812B  [5050]  87.28,35.73 0 top
L:LED21  WS2812B  [5050]  87.28,28.48 0 top
L:LED22  WS2812B  [5050]  87.28,21.23 0 top
L:LED23  WS2812B  [5050]  87.28,13.98 0 top
L:LED24  WS2812B  [5050]  87.28,6.73 0 top
L:LED25  WS2812B  [5050]  57.03,87.73 270 top
L:LED26  WS2812B  [5050]  49.78,87.73 270 top
L:LED27  WS2812B  [5050]  42.53,87.73 270 top
L:LED28  WS2812B  [5050]  35.28,87.73 270 top
L:LED29  WS2812B  [5050]  28.03,87.73 270 top
L:LED30  WS2812B  [5050]  20.78,87.73 270 top
L:LED31  WS2812B  [5050]  13.53,87.73 270 top
L:LED32  WS2812B  [5050]  6.28,87.73 270 top
L:R1  330R  [R0805]  45.78,20.23 0 top
P:X3  SCHALTREGLER  [3X1]  63.59,17.23 90 bottom
T1:C1  100nF  [C0805]  136.44,111.14 315 top
T1:IC1  MULTIPLEXER  [SO24]  124.74,112.18 315 top
T1:R1  20k  [R0805]  83.78,87.98 270 top
T1:R2  20k  [R0805]  83.78,95.23 270 top
T1:R3  20k  [R0805]  83.78,102.48 270 top
T1:R4  20k  [R0805]  83.78,109.73 270 top
T1:R5  20k  [R0805]  83.78,116.98 270 top
T1:R6  20k  [R0805]  83.78,124.23 270 top
T1:R7  20k  [R0805]  83.78,130.48 270 top
T1:R8  20k  [R0805]  83.78,136.73 270 top
T1:R9  20k  [R0805]  103.03,84.23 180 top
T1:R10  20k  [R0805]  110.28,84.23 180 top
T1:R11  20k  [R0805]  117.53,84.23 180 top
T1:R12  20k  [R0805]  124.78,84.23 180 top
T1:R13  20k  [R0805]  132.03,84.23 180 top
T1:R14  20k  [R0805]  139.28,84.23 180 top
T1:R15  20k  [R0805]  146.53,84.23 180 top
T1:R16  20k  [R0805]  153.78,84.23 180 top
T1:R17  10k  [R0805]  138.21,37.07 90 top
T1:T1  SFH320  [PLCC-2]  79.78,87.48 270 top
T1:T2  SFH320  [PLCC-2]  79.78,94.73 270 top
T1:T3  SFH320  [PLCC-2]  79.78,101.98 270 top
T1:T4  SFH320  [PLCC-2]  79.78,109.23 270 top
T1:T5  SFH320  [PLCC-2]  79.78,116.48 270 top
T1:T6  SFH320  [PLCC-2]  79.78,123.73 270 top
T1:T7  SFH320  [PLCC-2]  79.78,129.98 270 top
T1:T8  SFH320  [PLCC-2]  79.78,136.23 270 top
T1:T9  SFH320  [PLCC-2]  102.53,80.23 180 top
T1:T10  SFH320  [PLCC-2]  109.78,80.23 180 top
T1:T11  SFH320  [PLCC-2]  117.03,80.23 180 top
T1:T12  SFH320  [PLCC-2]  124.28,80.23 180 top
T1:T13  SFH320  [PLCC-2]  131.53,80.23 180 top
T1:T14  SFH320  [PLCC-2]  138.78,80.23 180 top
T1:T15  SFH320  [PLCC-2]  146.03,80.23 180 top
T1:T16  SFH320  [PLCC-2]  153.28,80.23 180 top
T2:C1  100nF  [C0805]  26.78,47.23 135 top
T2:IC1  MULTIPLEXER  [SO24]  37.78,46.23 135 top
T2:R1  20k  [R0805]  75.78,56.98 90 top
T2:R2  20k  [R0805]  75.78,49.73 90 top
T2:R3  20k  [R0805]  75.78,42.48 90 top
T2:R4  20k  [R0805]  75.78,35.23 90 top
T2:R5  20k  [R0805]  75.78,27.98 90 top
T2:R6  20k  [R0805]  75.78,20.73 90 top
T2:R7  20k  [R0805]  75.78,13.48 90 top
T2:R8  20k  [R0805]  75.78,6.23 90 top
T2:R9  20k  [R0805]  56.53,76.23 0 top
T2:R10  20k  [R0805]  49.28,76.23 0 top
T2:R11  20k  [R0805]  42.03,76.23 0 top
T2:R12  20k  [R0805]  34.78,76.23 0 top
T2:R13  20k  [R0805]  27.53,76.23 0 top
T2:R14  20k  [R0805]  20.28,76.23 0 top
T2:R15  20k  [R0805]  13.03,76.23 0 top
T2:R16  20k  [R0805]  5.78,76.23 0 top
T2:R17  10k  [R0805]  119.47,46.27 270 top
T2:T1  SFH320  [PLCC-2]  79.78,57.48 90 top
T2:T2  SFH320  [PLCC-2]  79.78,50.23 90 top
T2:T3  SFH320  [PLCC-2]  79.78,42.98 90 top
T2:T4  SFH320  [PLCC-2]  79.78,35.73 90 top
T2:T5  SFH320  [PLCC-2]  79.78,28.48 90 top
T2:T6  SFH320  [PLCC-2]  79.78,21.23 90 top
T2:T7  SFH320  [PLCC-2]  79.78,13.98 90 top
T2:T8  SFH320  [PLCC-2]  79.78,6.73 90 top
T2:T9  SFH320  [PLCC-2]  57.03,80.23 0 top
T2:T10  SFH320  [PLCC-2]  49.78,80.23 0 top
T2:T11  SFH320  [PLCC-2]  42.53,80.23 0 top
T2:T12  SFH320  [PLCC-2]  35.28,80.23 0 top
T2:T13  SFH320  [PLCC-2]  28.03,80.23 0 top
T2:T14  SFH320  [PLCC-2]  20.78,80.23 0 top
T2:T15  SFH320  [PLCC-2]  13.53,80.23 0 top
T2:T16  SFH320  [PLCC-2]  6.28,80.23 0 top
X:D1  DIODE  [DO-214BA]  103.68,19.02 270 bottom
X:R1  330R  [R0805]  45.78,17.73 180 top
X:X1  FTDI  [PIN-HEADER-ANGLED-6]  99.14,9.34 156.6 bottom
X:X2  WANNENSTECKER-10  [2X5-SHROUDED]  54.98,20.23 0 bottom

### Tracks (layer width: path | path; a pad name or v marks a point on that pad's centre or on a via)
+5V  (via drill 0.35, 1)
  Top 0.381: L:LED23.VDD 84.68,15.73 | T1:IC1.24 134.13,112.67 134.93,112.67 135.68,111.91 T1:C1.1 | T2:IC1.24 29.34,44.67 T2:C1.1
  Top 0.508: 123.42,38.05 124.4,38.05 125.22,37.23 A:IC1.18 | 123.42,38.05 122.84,38.05 | 122.84,38.05 122.34,38.05 | 122.34,38.05 119.56,38.05 A:IC1.6 | A:R3.2 | A:IC1.4 121.84,39.63 122.34,39.13 | 122.34,39.13 122.34,38.55 | 122.34,38.55 122.34,38.05 | 122.34,38.55 122.84,38.05 | 122.34,39.13 123.42,38.05
  Top 0.635: T1:R7.2 81.54,127.3 78.37,127.3 78.36,127.31 | 78.36,121.09 81.57,121.09 83.76,123.28 T1:R6.2 | T1:R8.2 81.57,133.58 78.36,133.58 78.36,127.31 | T1:R4.2 81.6,106.6 78.36,106.6 | T1:R3.2 81.55,99.31 78.36,99.31 | T1:R2.2 81.54,92.05 78.36,92.05 | T1:R5.2 81.57,113.82 78.4,113.82 78.36,113.79 | 78.36,127.31 78.36,121.09 | 78.36,121.09 78.36,113.79 | 78.36,113.79 78.36,106.6 | 78.36,106.6 78.36,99.31 | 78.36,99.31 78.36,92.05 | T1:R1.2 81.59,84.85 78.36,84.85 78.36,92.05 | 75.23,134.63 L:LED8.VDD 74.33,134.63 72.8,136.16 L:C5.1 66.78,131.27 68.4,129.65 72.97,129.65 74.23,128.38 L:LED7.VDD 75.12,128.38 76.52,126.99 76.52,123.3 75.35,122.13 L:LED6.VDD | L:LED2.VDD 75.16,93.13 | L:LED3.VDD 75.16,100.38 | L:LED4.VDD 75.26,107.63 | L:LED5.VDD 75.24,114.88 | L:C2.1 66.72,94.25 66.72,88.8 67.72,87.8 72.29,87.8 74.21,85.88 L:LED1.VDD 74.85,85.76 L:C1.1 | 67,94.38 72.92,94.38 74.17,93.13 L:LED2.VDD | L:LED3.VDD 74.3,100.38 73.08,101.6 68.49,101.6 68.39,101.6 66.78,103.21 L:C3.1 72.74,109.16 74.27,107.63 L:LED4.VDD | L:LED5.VDD 74.17,114.88 72.88,116.17 68.61,116.17 66.78,118.01 L:C4.1 | L:LED3.VDD 75.12,100.38 76.47,99.04 76.47,94.45 75.16,93.13 | 75.16,93.13 L:LED2.VDD | L:LED5.VDD 75.09,114.88 76.46,113.51 76.46,108.74 75.35,107.63 L:LED4.VDD | L:C6.1 100.81,70.16 L:LED9.VDD 100.93,69.82 102.33,68.42 106.78,68.42 108.18,69.81 L:LED10.VDD 108.18,69.82 109.52,68.48 112.19,68.48 114,70.28 L:LED11.VDD 115.4,70.26 | T1:R10.2 107.09,82 107.09,77.87 | T1:R14.2 136.16,82.06 136.16,77.87 | T1:R9.2 99.87,82.03 99.87,77.87 107.09,77.87 | T1:R15.2 143.32,81.97 143.32,77.87 | T1:R16.2 150.56,81.97 150.56,77.87 143.32,77.87
  Top 0.635: 151.68,70.21 L:LED16.VDD | 144.47,70.24 L:LED15.VDD | L:LED16.VDD | L:LED17.VDD 84.43,59.08 83.04,57.69 83.04,53.19 84.4,51.83 L:LED18.VDD 85.21,51.83 86.46,50.58 91,50.58 92.78,48.8 L:C11.1 | L:C11.1 | L:C11.1 92.75,43.08 86.8,43.08 85.3,44.58 L:LED19.VDD 83.11,42.86 83.11,38.71 84.48,37.33 L:LED20.VDD 85.25,37.33 86.47,36.11 91.84,36.11 v92.66,35.3 92.66,28.67 L:C12.1 86.73,28.56 85.21,30.08 L:LED21.VDD 84.46,30.08 82.89,28.52 82.89,24.46 84.52,22.83 L:LED22.VDD 85.27,22.83 86.66,21.44 91.07,21.44 92.78,19.73 L:C13.1 86.95,13.96 85.32,15.58 L:LED23.VDD 84.52,15.58 83.04,14.11 83.04,9.7 84.4,8.33 L:LED24.VDD | T2:R1.2 78.05,60.22 81.05,60.22 81.05,64.71 v79.53,66.23 | 76,28.93 T2:R5.2 77.98,31.14 81.05,31.14 | 75.96,21.68 T2:R6.2 77.95,23.86 81.05,23.86 | 76.04,14.43 T2:R7.2 78.08,16.74 81.05,16.74 | T2:R8.2 77.98,9.38 79.88,9.38 81.05,10.56 81.05,16.74 | 81.05,45.65 81.05,53 78.09,53 T2:R2.2 | 81.05,45.65 81.05,38.48 | 81.05,38.48 81.05,31.14 | 81.05,31.14 81.05,23.86 | 81.05,23.86 81.05,16.74 | L:LED28.VDD 36.91,90.21 | L:LED27.VDD 45.57,90.18 47.3,91.92 50.1,91.92 51.38,90.64 L:LED26.VDD 51.38,90.59 52.82,92.03 57.34,92.03 58.63,90.73 L:LED25.VDD 62.36,90.18 L:C14.1 | 29.66,90.21 L:LED29.VDD 31,90.18 32.84,92.02 35.41,92.02 36.88,90.55 L:LED28.VDD | L:LED30.VDD 22.38,90.46 | 36.88,90.46 L:LED28.VDD | L:LED14.VDD 137.18,70.01 | L:LED16.VDD 151.68,70.01 | L:LED14.VDD 137.18,69.88 138.54,68.51 141.26,68.51 143.03,70.28 L:LED15.VDD | L:LED15.VDD 144.44,70.27 | 137.18,69.95 L:LED14.VDD | L:LED12.VDD 122.68,69.9 124.13,68.45 126.61,68.45 128.44,70.28 L:LED13.VDD
  Top 0.635: L:LED28.VDD 36.88,90.4 | 54.03,81.82 45.16,81.82 45.16,78.41 T2:R11.2 | 46.83,81.82 37.99,81.82 37.99,78.5 T2:R12.2 | 39.57,81.82 30.71,81.82 30.71,78.47 T2:R13.2 | 32.14,81.82 23.45,81.82 23.45,78.45 T2:R14.2 | 25.09,81.82 16.16,81.82 16.16,78.41 T2:R15.2 | 17.87,81.82 10.61,81.82 8.92,80.13 8.92,78.43 T2:R16.2 6.78,76.18 | T2:R9.2 59.74,78.5 59.74,81.82 52.43,81.82 52.43,78.44 T2:R10.2 | A:IC1.18 134.07,37.23 | 134.07,37.23 135.87,37.23 136.98,36.12 T1:R17.1 138.22,36.14 141.62,36.14 143.23,37.75 | T2:R17.1 115.16,47.22 v115.14,47.2 | A:R3.2 116.71,52.61 | v111.63,56.06 106.45,56.06 | T2:R3.2 78,45.65 81.05,45.65 | T2:R4.2 78.07,38.48 81.05,38.48 | 136.16,77.87 143.32,77.87 | 107.09,77.87 114.11,77.87 | 114.11,77.87 121.53,77.87 | 121.53,77.87 128.79,77.87 | 128.79,77.87 136.16,77.87 | 121.53,77.87 121.53,81.94 T1:R12.2 | 128.79,77.87 128.79,81.95 T1:R13.2 | 114.11,77.87 114.11,81.77 T1:R11.2 | 134.07,37.23 134.07,34.46 A:C2.1 A:C4.1 134.15,28.52 133.24,27.61 A:C3.1 | T1:C1.1 137.52,111.89 139.78,109.63 | T2:C1.1 25.55,46.48 23.91,48.12 | v103.68,24.36 103.68,26.34 95.4,34.62 v95.39,34.62 | L:LED31.VDD 15.23,90.28
  Top 1.905: P:X3.1 58.88,12.52 v58.88,12.49 | v49,9.45 31.26,27.19 31.26,40.58 40.38,49.7 v40.4,49.7 | v46.5,55.77 46.5,55.89 63.13,72.52 63.13,75.43 64.44,76.73 v67.28,76.73
  Bottom 0.635: v115.14,47.2 115.14,52.49 v115.17,52.52 115.17,52.53 111.64,56.06 v111.63,56.06 | v95.39,34.62 94.72,35.3 v92.66,35.3 | X:D1.1 v103.68,24.36
  Bottom 1.778: P:X3.1 v70.39,17.23 v70.4,17.23
  Bottom 1.905: v58.88,12.49 55.84,9.45 v49,9.45 | v46.5,55.77 46.45,55.77 40.4,49.72 v40.4,49.7
  Bottom 2.54: v67.28,76.73 v71.28,72.73 | v80.78,75.23 v84.28,78.73 | v152.78,94.98 v152.78,87.23 | v78.03,66.23 v84.78,66.23 | v6.78,73.73 v6.78,66.23
  other vias: 69.01,17.23 69.69,17.67 69.71,16.86 68.28,75.73 68.28,76.73 67.28,75.73 70.28,73.73 71.28,73.73 70.28,72.73 83.28,77.73 81.78,76.23 80.78,76.23 81.78,75.23 83.28,78.73 84.28,77.73 153.53,87.98 152.78,88.73 152.03,87.98 153.53,94.23 152.78,93.48 152.03,94.23 84.03,66.98 83.28,66.23 84.03,65.48 78.78,66.98 78.78,65.48 7.53,72.98 6.78,72.23 6.03,72.98 6.78,67.73 6.03,66.98 7.53,66.98
  pour Top (isolate 0.5, no thermals): -2.17,46.56 46.49,-2.1 113.08,-2.1 162.34,47.16 162.34,113.44 132.99,142.8 26.72,142.8 -2.08,114
  cutout Top: 53.25,145.04 2,93.79 -12.92,93.79 -12.92,121.06 19.81,153.79 44.5,153.79
  cutout Top: 66.32,8.81 74.08,1.05 74.08,-6.23 39.78,-6.23 -6.54,40.1 -6.54,61.8 1.39,69.73 25.29,45.83 31.22,51.77 43.3,51.77 44.01,51.06 44.01,21.01 56.22,8.8 66.34,8.8
  cutout Top: 133.63,45.73 156.93,22.44 136.29,1.8 94.4,1.8 94.4,36.6 94.98,37.17
  cutout Top: 107.82,142.81 160.11,90.52 183.41,90.52 130.31,143.63 108.64,143.63
  cutout Top: 85.25,141.52 85.25,89.54 85.84,88.95 98.87,101.98 127.27,101.98 139.58,114.29 112.36,141.52
  cutout Top: 115.79,85.57 147.74,85.57 147.74,88.74 147.74,89.76 154.79,89.76 135.86,108.69 127.54,117.01 119.03,117.01 109.56,107.54 109.56,91.41 115.34,85.63 115.85,85.63
  cutout Top: 5.19,71.38 12.2,71.38 12.2,65.49 23.25,54.44 48.76,54.44 68.46,74.14 12.2,74.14 12.2,71.31
  cutout Top: 63.03,68.03 63.03,55.6 63.09,55.55 49.9,55.55 49.85,55.6 62.38,68.14 62.98,68.14
  cutout Top: 70.45,75.45 76.19,75.45 76.5,75.75 71.3,80.95 70.31,80.95 70.31,75.58 70.42,75.47
  cutout Top: 107.49,68.29 107.49,54.26 107.58,54.16 121.22,54.16 121.41,54.36
  cutout Top: 66.05,22.51 73.1,22.51 73.19,22.42 73.19,46.36 73,46.55 61.41,46.55 61.41,26.78 65.67,22.51
  cutout Top: 68.36,12.74 68.36,8.52 73.2,3.67 74.59,3.67 74.59,10.78 72.71,12.67 68.36,12.67
  cutout Top: 89.23,75.56 89.23,68.85 89.77,68.31 96.34,74.88 96.41,74.88 95.73,75.56
+12V
  Top 1.27: X:X2.5 61.51,20.23 P:X3.3 63.59,26.85 62.12,28.32 55.2,28.32 53.71,26.82 X:X2.2
A:MISO  (via drill 0.38)
  Top 0.381: A:IC1.16 126.58,32.78 127.94,31.42 v127.94,27.81
  Bottom 0.381: A:TP2.TP 127.95,25.58 v127.95,27.81 v127.94,27.81
A:MOSI  (via drill 0.38)
  Top 0.381: A:IC1.15 v125.78,31.56 v125.78,31.55
  Bottom 0.381: v125.78,31.55 125.78,29.57 A:TP3.TP
A:N$1
  Top 0.381: A:IC1.11 A:R1.1
A:N$2
  Top 0.381: A:IC1.8 119.52,36.41 116.52,36.41 A:Q1.1 114.53,34.4 A:C7.1
A:N$3
  Top 0.381: A:IC1.7 119.52,37.21 116.58,37.21 A:Q1.2 114.53,39.23 A:C6.2
A:N$4  (via drill 0.38)
  Top 0.381: v126.16,23.49 126.11,23.49 A:R1.2
  Bottom 0.381: v126.16,23.49 126.16,21.36 A:LED1.A
A:N$8
  Top 0.381: A:IC1.20 132.32,38.83 132.94,39.45 A:C5.1
A:N$9  (via drill 0.35)
  Top 0.381: v124.97,38.78 124.98,38.79 A:IC1.27 | v121.48,20.58 121.48,31.73 v121.52,31.77
  Bottom 0.381: A:S2.A1 v121.48,20.58 A:S2.A2 | v121.52,31.77 124.97,35.23 v124.97,38.78
A:N$10  (via drill 0.35)
  Top 0.381: A:R2.2 131.5,27.27 130.45,26.22 v130.45,26.2
  Bottom 0.381: A:LED2.A 130.42,26.17 v130.45,26.2
A:N$11  (via drill 0.35)
  Top 0.381: A:IC1.28 v124.18,41.92 | v125.71,41.91 v125.71,38.1 | A:R2.1 128.82,34.88 v128.8,34.9
  Bottom 0.381: v124.18,41.92 v125.7,41.92 v125.71,41.91 | v128.8,34.9 128.8,35.01 v125.71,38.1
A:SCK  (via drill 0.38)
  Top 0.381: A:IC1.17 128.01,32.68 v128.77,31.92
  Bottom 0.381: A:TP1.TP v128.77,31.92
A:SS  (via drill 0.38)
  Top 0.381: A:IC1.14 124.98,27.86 v124.97,27.85
  Bottom 0.381: v124.97,27.85 | v124.97,27.85 124.97,25.78 A:TP4.TP
ARD-INTERRUPT  (via drill 0.35)
  Top 0.381: X:R1.2 44.83,17.68 52.99,9.52 67.44,9.52 73.47,3.49 91.55,3.49 v108.95,20.89 | A:IC1.10 121.78,33.66 v112.39,24.28
  Bottom 0.381: v108.95,20.89 112.33,24.28 v112.39,24.28
ARD-RESET  (via drill 0.35)
  Top 0.254: A:R3.1 119.76,50.64 A:C1.2 121.11,50.66 123.38,48.39 A:IC1.29
  Top 0.381: X:X2.10 58.79,10.08 67.66,10.08 73.7,4.04 86.18,4.04 89.34,7.2 91.86,7.2 93.95,9.29 v93.95,45.18 | A:R3.1 114.19,50.64 113.61,50.06 98.82,50.06 v98.83,50.05
  Bottom 0.254: 93.97,45.18 v93.95,45.18
  Bottom 0.381: v98.83,50.05 93.97,45.18
DTR  (via drill 0.35)
  Top 0.381: X:X1.6 112.5,22.58 96.5,38.58 96.48,38.58 v96.48,42.92 v96.49,42.93 | A:C1.1 119.61,52.81 118.79,53.62 107.18,53.62 v104.57,51 v104.56,51
  Bottom 0.381: v104.56,51 97.05,43.48 | 97.05,43.48 | 97.05,43.48 v96.49,42.93
GND  (via drill 0.35, 0.38)
  Top 0.381: v46.99,48.76 46.99,48.7 T2:IC1.12 | T1:IC1.12 115.52,109.71 v115.48,109.71 | A:C5.2 136.36,39.63 v136.38,39.61 | A:C6.1 107.07,39.23 v107.04,39.2 | A:C7.2 108.69,34.38 107.05,34.38 v107.01,34.42 | A:IC1.21 126.49,39.63 v126.44,39.68
  Top 0.508: A:C3.2 v134.55,26.87 v134.55,26.88
  Top 0.635: T1:T5.C 79.78,116.43 v79.76,116.45 | T1:T4.C 79.78,109.22 v79.75,109.25 | v79.79,101.99 T1:T3.C | T1:T2.C 79.81,93.31 v79.81,94.75 | T1:T1.C v79.78,87.44 | v79.76,123.66 79.76,122.3 T1:T6.C | T1:T7.C v79.78,129.97 | T1:T8.C v79.78,136.23 | T1:T9.C 101.12,80.28 v102.51,80.28 | T1:T10.C 108.35,80.25 v109.62,80.25 | T1:T11.C v117.01,80.23 | T1:T12.C v124.27,80.23 | T1:T13.C v131.56,80.23 | T1:T14.C v138.82,80.23 | T1:T15.C 146.05,80.23 v146.06,80.22 | T1:T16.C 151.86,80.21 v153.29,80.21 | L:LED7.GND v67.72,131.58 v67.72,131.59 | v65.05,138.3 v65.05,138.31 L:C5.2 67.82,138.31 68.3,137.83 L:LED8.GND | L:LED5.GND 67.96,118.08 v67.93,118.11 | v65.07,125.81 L:C4.2 67.8,125.81 68.28,125.33 L:LED6.GND | v65.2,111.3 v65.2,111.31 L:C3.2 67.83,111.31 68.29,110.84 L:LED4.GND | L:LED3.GND v67.85,103.58 | v65.32,96.8 65.33,96.81 L:C2.2 67.85,96.81 68.31,96.34 L:LED2.GND | v156.75,75.19 v156.74,75.18 L:LED16.GND | T2:T1.C 79.78,57.47 v79.76,57.45 | T2:T2.C v79.78,50.27 | T2:T4.C v79.78,35.66 | T2:T5.C v79.78,28.37 | T2:T7.C v79.78,13.92 | T2:T8.C v79.78,6.76 | L:LED9.GND 104.13,74.66 101.77,72.31 L:C6.2 v95.25,72.31 | L:LED1.GND v67.96,89.08 v67.95,89.07 | L:C1.2 72.71,80.69 v72.67,80.65 | L:LED17.GND 89.28,55.88 86.85,58.32 L:C10.2 86.92,63 v88.46,63 | L:LED18.GND 91.56,48.63 v91.58,48.62 | L:LED19.GND 91.29,41.38 91.76,40.91 L:C11.2 92.78,39.31 v92.76,39.29 | L:LED20.GND 90.32,33.54 v91.8,33.54 | L:LED21.GND 91.19,26.88 91.66,26.41 L:C12.2 92.78,26.37 v92.78,24.92 | L:LED22.GND 89.79,19.57 v91.72,19.57 | 90.59,12.38 L:LED23.GND 91.25,12.38 91.82,11.81 L:C13.2 v92.78,10.64 v92.77,10.63 | L:LED24.GND 92.02,5.13 v92.07,5.09
  Top 0.635: T2:T3.C v79.78,43 | T2:T6.C v79.78,21.16 | L:LED25.GND 55.43,85.68 57.91,88.16 L:C14.2 v62.48,86.75 | L:LED26.GND v48.18,83.34 v48.19,83.33 | L:LED27.GND 40.93,85.85 42.18,87.1 42.18,92.96 L:C15.2 40.94,92.98 v40.91,92.95 | L:LED28.GND 33.68,83.31 v33.66,83.29 | L:LED29.GND 26.43,85.68 27.71,86.96 L:C16.2 26.29,92.98 v26.28,92.97 | L:LED30.GND 19.18,82.96 v19.16,82.94 | L:LED32.GND 4.68,83.22 v4.66,83.21 | T2:T16.C 7.68,80.18 v6.35,80.18 | T2:T15.C 14.95,80.21 v13.53,80.21 | T2:T14.C 22.2,80.21 v20.76,80.21 | T2:T13.C v28.02,80.23 | T2:T12.C v35.23,80.23 | T2:T11.C v42.49,80.23 | T2:T10.C v49.7,80.23 | T2:T9.C v57.03,80.23 | L:LED10.GND 109.64,75.18 v109.62,75.2 | L:LED12.GND 124.38,75.18 v124.36,75.2 | L:LED15.GND 145.97,73.53 145.97,68.47 146.85,67.59 L:C9.2 148.36,67.48 v148.38,67.5 | L:LED13.GND 131.25,73.31 131.25,68.73 132.35,67.63 L:C8.2 v134.03,67.48 v134.04,67.49 | L:LED11.GND 118.63,74.81 117.02,73.2 117.02,68.54 117.85,67.71 L:C7.2 119.29,67.48 v119.31,67.5 | A:IC1.3 117.61,40.43 v117.57,40.47 | A:IC1.5 117.61,38.83 v117.57,38.87 | L:LED14.GND v138.8,75.18 | A:C2.2 137.54,34.4 v137.57,34.42 | A:C4.2 136.33,31.74 v137.57,31.74 | T1:C1.2 v138.5,109.07 | T2:C1.2 v24.91,49.1 v24.91,49.11 | L:LED31.GND 11.93,85.83 13.15,87.05 13.15,92.92 L:C17.2 13.03,92.93 v11.68,92.93
  Bottom 0.635: A:LED1.C 128.06,18.33 130.4,20.66 A:LED2.C | v109.62,75.2 v109.62,80.25 | v109.62,80.25 | v109.62,80.25 109.62,89.12
  pour Bottom (isolate 0.8): 165.01,114.07 133.93,145.15 25.07,145.15 -5.15,114.93 -5.15,46.43 46.04,-4.77 113.29,-4.77 165.01,46.96
L:CON-1
  Top 0.381: L:LED8.OUT 75.16,137.83 77.49,135.51 77.49,81.91 84.21,75.18 L:LED9.IN
L:CON-2
  Top 0.381: L:LED16.OUT 153.32,71.84 153.32,76.09 152.34,77.06 103.52,77.06 102.69,76.23 102.69,74.46 101.52,73.29 94.37,73.29 89.73,68.64 L:LED17.IN
L:CON-3
  Top 0.381: L:LED24.OUT 84.23,5.13 81.91,7.46 81.91,70.05 81.91,70.26 71.69,80.48 71.69,86.39 71.1,86.99 68.45,86.99 66.75,85.28 L:LED25.IN
L:LED-IN1
  Top 0.381: L:LED2.OUT 74.7,96.31 74.36,96.31 70.28,100.38 L:LED3.IN
L:LED-IN2
  Top 0.381: L:LED4.OUT 72.48,110.83 69.83,113.49 L:LED5.IN
L:LED-IN3
  Top 0.381: L:LED6.OUT 74.64,125.42 73.26,125.42 70.3,128.38 L:LED7.IN
L:LED-IN4
  Top 0.381: L:LED26.OUT 48.18,89.77 44.13,85.72 L:LED27.IN
L:LED-IN5
  Top 0.381: L:LED10.OUT 111.38,70.71 115.43,74.76 L:LED11.IN
L:LED-IN6
  Top 0.381: L:LED12.OUT 125.88,70.55 129.93,74.6 L:LED13.IN
L:LED-IN7
  Top 0.381: L:LED14.OUT 140.38,70.65 144.43,74.7 L:LED15.IN
L:LED-IN8
  Top 0.381: L:LED28.OUT 33.68,89.82 29.63,85.77 L:LED29.IN
L:LED-IN9
  Top 0.381: L:LED18.OUT 85.31,48.63 89.36,44.58 L:LED19.IN
L:LED-IN10
  Top 0.381: L:LED20.OUT 85.33,34.13 89.38,30.08 L:LED21.IN
L:LED-IN11
  Top 0.381: L:LED22.OUT 85.25,19.63 89.3,15.58 L:LED23.IN
L:LED-IN12
  Top 0.381: L:LED30.OUT 19.18,89.79 15.13,85.74 L:LED31.IN
L:N$1
  Top 0.381: L:LED4.IN 69.83,106.02 72.26,103.58 L:LED3.OUT
L:N$2
  Top 0.381: L:LED1.OUT 74.32,89.08 70.27,93.13 L:LED2.IN
L:N$3
  Top 0.381: L:LED25.OUT 55.43,89.83 51.38,85.78 L:LED26.IN
L:N$4
  Top 0.381: L:LED5.OUT 74.28,118.08 70.23,122.13 L:LED6.IN
L:N$5
  Top 0.381: L:LED28.IN 36.88,85.81 40.93,89.86 L:LED27.OUT
L:N$6
  Top 0.381: L:LED29.OUT 26.43,89.76 22.38,85.71 L:LED30.IN
L:N$7
  Top 0.381: L:LED7.OUT 73.34,131.58 70.29,134.63 L:LED8.IN
L:N$8
  Top 0.381: L:LED31.OUT 11.93,89.78 7.88,85.73 L:LED32.IN
L:N$9
  Top 0.381: L:LED9.OUT 104.13,70.61 108.18,74.66 L:LED10.IN
L:N$10  (via drill 0.35)
  Top 0.381: L:R1.1 44.83,20.37 34.49,30.71 34.49,40.15 v44.18,49.84 | L:LED1.IN 69.83,75.5 v49.14,54.81
  Bottom 0.381: v44.18,49.84 49.14,54.8 v49.14,54.81
L:N$11
  Top 0.381: L:LED11.OUT 118.63,70.61 122.68,74.66 L:LED12.IN
L:N$12
  Top 0.381: L:LED13.OUT 133.13,70.72 137.18,74.77 L:LED14.IN
L:N$13
  Top 0.381: L:LED15.OUT 147.63,70.6 151.68,74.65 L:LED16.IN
L:N$14
  Top 0.381: L:LED18.IN 87.23,51.83 84.83,54.23 L:LED17.OUT
L:N$16
  Top 0.381: L:LED19.OUT 85.28,41.38 89.33,37.33 L:LED20.IN
L:N$17
  Top 0.381: L:LED21.OUT 87.21,26.88 89.73,24.36 L:LED22.IN
L:N$18
  Top 0.381: L:LED24.IN 87.35,8.33 84.83,10.85 L:LED23.OUT
LED-IN
  Top 0.381: L:R1.2 X:X2.6
N$2  (via drill 0.35)
  Top 0.381: T2:IC1.1 35.61,38.52 35.61,39.95 45.22,49.56 v45.31,49.56 | A:IC1.32 v120.98,47.07 v120.97,47.07 | v123.47,49.53 123.47,53.28 122.33,54.42 92.41,54.42 91.62,55.22 v91.62,55.23 | v73.28,55.23 73.25,55.26 v50.9,55.26
  Bottom 0.381: v50.9,55.26 45.31,49.66 v45.31,49.56 | v50.9,55.26 | v120.97,47.07 123.43,49.53 v123.47,49.53 | v91.62,55.23 91.61,55.22 v73.28,55.23
N$3  (via drill 0.38)
  Top 0.381: T2:IC1.15 38.14,52.16 73.25,52.16 v73.28,52.13 | A:IC1.1 119.47,42.11 T2:R17.2 98.6,45.32 v91.78,52.13
  Bottom 0.381: v73.28,52.13 v91.78,52.13
N$4  (via drill 0.38)
  Top 0.381: T2:IC1.11 45.73,46.36 66.59,46.36 67.85,47.62 78.81,47.61 78.8,47.63 v78.78,47.63 | v93.78,47.63 96.82,44.59 114.17,44.59 117.45,41.31 119.47,41.31 A:IC1.2
  Bottom 0.381: v93.78,47.63 93.75,47.61 v78.78,47.63
N$5  (via drill 0.38)
  Top 0.381: T2:IC1.10 44.88,45.42 67.09,45.42 68.19,46.51 77.37,46.51 v77.41,46.47 | A:IC1.9 120.98,34.38 119.72,33.12 105.35,33.12 103.12,35.35 103.12,41.98 101.31,43.79 96.42,43.79 v93.78,46.43
  Bottom 0.381: v77.41,46.47 93.74,46.47 v93.78,46.43
N$6  (via drill 0.38)
  Top 0.381: T2:IC1.14 39,53.1 73.29,53.1 v73.28,53.09 | v113.4,46.45 98.53,46.45 91.89,53.09 v87.28,53.09 | v123.38,36.5 A:IC1.12
  Bottom 0.381: v113.4,46.45 113.38,46.47 113.41,46.47 v123.38,36.5 | v87.28,53.09 87.24,53.09 73.3,53.09 v73.28,53.09
N$7  (via drill 0.35, 0.38)
  Top 0.381: T2:IC1.13 39.87,54.02 73.22,54.02 v73.28,54.04 | v113.73,47.57 98.3,47.57 91.83,54.04 v86.28,54.04 | A:IC1.13 v124.18,37.13
  Bottom 0.381: 114.12,47.21 | 114.12,47.21 113.75,47.57 v113.73,47.57 | 114.12,47.21 124.18,37.15 v124.18,37.13 | v86.28,54.04 85.79,54.04 v73.28,54.04
N$8  (via drill 0.38)
  Top 0.381: T1:IC1.13 123.71,103.33 123.71,99.53 v111.78,87.23 | A:IC1.23 129.56,41.23 129.94,41.62 129.94,56.86 129.12,57.68 120.83,57.68 v111.78,66.73
  Bottom 0.381: v111.78,87.23 v111.78,66.73
N$9  (via drill 0.35, 0.38)
  Top 0.381: T1:IC1.14 124.66,104.18 124.66,99.45 v113.1,87.45 | v112.98,66.73 121.02,58.69 v128.1,58.69 | A:IC1.24 128.01,55.62 v128.04,55.65
  Bottom 0.381: v113.1,87.45 113.1,66.86 v112.98,66.73 | v128.04,55.65 128.04,58.63 v128.1,58.69
N$10  (via drill 0.38)
  Top 0.381: T1:IC1.10 117.69,112.94 111.33,112.94 107.57,109.19 v107.57,87.24 v107.58,87.23 | A:IC1.25 126.59,54.2 125.83,54.96 119.35,54.96 v107.58,66.73
  Bottom 0.254: v107.58,66.73 107.58,66.72
  Bottom 0.381: v107.58,87.23 107.58,66.72
N$11  (via drill 0.38)
  Top 0.381: T1:IC1.11 116.74,112.1 111.57,112.1 108.67,109.2 108.67,87.25 v108.68,87.23 | v125.77,53.97 v125.78,53.97 A:IC1.26 | v108.68,66.73 119.55,55.86 v125.79,55.86 | v108.68,66.73
  Bottom 0.381: v108.68,87.23 v108.68,66.73 | v125.79,55.86 125.79,53.99 v125.77,53.97
N$12  (via drill 0.38)
  Top 0.381: A:IC1.19 T1:R17.2 138.21,39.85 131.84,46.22 131.84,56.99 129.26,59.58 121.33,59.58 v114.18,66.73 | T1:IC1.15 125.57,105.07 125.57,99.05 v114.18,87.23
  Bottom 0.381: v114.18,87.23 v114.18,66.73
N$13  (via drill 0.38)
  Top 0.381: T1:IC1.1 126.89,119.91 126.89,118.04 110.58,101.73 v110.58,87.23 | v110.58,66.73 120.54,56.77 128.81,56.77 v128.88,56.69 | v128.88,56.69 | v130.82,54.96 130.82,41.52 129.73,40.43 A:IC1.22
  Bottom 0.381: v110.58,87.23 v110.58,66.73 | v128.88,56.69 128.94,56.69 130.67,54.96 v130.82,54.96
RX  (via drill 0.35)
  Top 0.381: v94.69,44.46 94.66,44.44 94.66,37.85 110.17,22.35 X:X1.5 103.01,13.84 98.29,9.12 v98.26,9.12 | v99.52,49.23 99.52,49.25 121.29,49.25 122.58,47.95 A:IC1.30 | X:X2.3 57.07,23.6 v62.13,23.6 | v92.49,9.12 92.46,9.12 91.91,9.67 87.9,9.67 86.71,10.85 v86.7,10.85 | v65.65,23.61 v65.66,23.6 65.66,16.39 71.19,10.85 v80.09,10.85
  Bottom 0.381: v94.69,44.46 99.52,49.29 v99.52,49.23 | v86.7,10.85 v86.69,10.85 v80.09,10.85 | v65.65,23.61 v65.64,23.6 v62.13,23.6 | v92.49,9.12 v98.26,9.12 | v98.26,9.12
T1:N$1
  Top 0.381: T1:T1.A T1:R1.1 85.84,88.93 110.76,113.85 118.58,113.85 T1:IC1.9
T1:N$2
  Top 0.381: T1:T2.A T1:R2.1 91.53,96.18 110.11,114.76 119.47,114.76 T1:IC1.8
T1:N$3
  Top 0.381: T1:T3.A T1:R3.1 97.42,103.44 109.61,115.63 120.4,115.63 T1:IC1.7
T1:N$4
  Top 0.381: T1:T4.A T1:R4.1 103.35,110.68 109.24,116.57 121.25,116.57 T1:IC1.6
T1:N$5
  Top 0.381: T1:T5.A T1:R5.1 87.66,117.93 93.46,123.74 115.88,123.74 T1:IC1.5
T1:N$7
  Top 0.381: T1:T9.A T1:R9.1 105.52,85.78 113.91,85.78 126.46,98.32 126.46,106.02 125.91,106.56 T1:IC1.16
T1:N$9
  Top 0.381: T1:T8.A T1:R8.1 107.32,137.68 T1:IC1.2
T1:N$10
  Top 0.381: T1:T7.A T1:R7.1 111.77,131.43 T1:IC1.3
T1:N$11
  Top 0.381: T1:T6.A T1:R6.1 116.23,125.18 T1:IC1.4
T1:N$12
  Top 0.381: T1:T10.A T1:R10.1 113.57,84.23 127.37,98.03 127.37,106.85 T1:IC1.17
T1:N$14
  Top 0.381: T1:T11.A T1:R11.1 118.48,87.88 128.22,97.62 128.22,107.9 127.76,108.36 T1:IC1.18
T1:N$18
  Top 0.381: T1:T13.A T1:R13.1 135.39,86.65 135.39,104.3 129.53,110.16 T1:IC1.20
T1:N$20
  Top 0.381: T1:T14.A T1:R14.1 140.23,101.18 131.41,110 T1:IC1.21
T1:N$22
  Top 0.381: T1:T15.A T1:R15.1 147.48,95.73 T1:IC1.22
T1:N$25
  Top 0.381: T1:T16.A T1:R16.1 154.71,84.25 154.71,90.29 T1:IC1.23
T1:N$26
  Top 0.381: T1:T12.A T1:R12.1 125.73,93.9 129.16,97.34 129.16,108.66 T1:IC1.19
T2:N$1  (via drill 0.35)
  Top 0.381: T2:T1.A 75.84,56.1 T2:R1.1 74.32,54.57 74.32,51.52 v71.59,48.78 | T2:IC1.9 43.4,44.96 43.81,44.54 67.41,44.54 v68.58,45.71
  Bottom 0.381: v68.58,45.71 71.65,48.78 v71.59,48.78
T2:N$2  (via drill 0.35)
  Top 0.381: T2:T2.A T2:R2.1 v72.7,48.78 | T2:IC1.8 43.09,43.62 67.53,43.62 v68.69,44.78
  Bottom 0.381: v68.69,44.78 v72.69,48.78 v72.7,48.78
T2:N$3
  Top 0.381: T2:T3.A T2:R3.1 69.72,35.48 49.43,35.48 T2:IC1.7
T2:N$4
  Top 0.381: T2:T4.A T2:R4.1 48.83,34.28 T2:IC1.6
T2:N$5
  Top 0.381: T2:T5.A T2:R5.1 75.74,27.03 69.59,33.18 48.13,33.18 T2:IC1.5
T2:N$7
  Top 0.381: T2:T9.A T2:R9.1 55.54,76.23 36.11,56.8 36.11,52.39 T2:IC1.16
T2:N$9
  Top 0.381: T2:T8.A T2:R8.1 75.71,5.28 64.92,16.07 64.92,27.85 62.64,30.14 45.79,30.14 T2:IC1.2
T2:N$10
  Top 0.381: T2:T7.A T2:R7.1 71.12,12.53 66.57,17.09 66.57,27.74 63.17,31.13 46.6,31.13 T2:IC1.3
T2:N$11
  Top 0.381: T2:T6.A T2:R6.1 75.7,19.78 63.36,32.12 47.4,32.12 T2:IC1.4
T2:N$12
  Top 0.381: T2:T10.A T2:R10.1 48.24,76.23 35.18,63.18 35.18,51.52 T2:IC1.17
T2:N$14
  Top 0.381: T2:T11.A T2:R11.1 41.08,76.18 34.34,69.44 34.34,50.57 T2:IC1.18
T2:N$18
  Top 0.381: T2:T13.A T2:R13.1 24.6,74.26 24.6,56.71 T2:IC1.20
T2:N$20
  Top 0.381: T2:T14.A T2:R14.1 19.33,60.19 T2:IC1.21
T2:N$22
  Top 0.381: T2:T15.A T2:R15.1 12.26,76.05 12.26,65.46 T2:IC1.22
T2:N$25
  Top 0.381: T2:T16.A T2:R16.1 4.83,71.1 T2:IC1.23
T2:N$26
  Top 0.381: T2:T12.A T2:R12.1 33.8,76.21 33.8,68.16 33.37,67.73 33.37,49.75 T2:IC1.19
TX  (via drill 0.35)
  Top 0.254: X:X2.4 53.71,21.96 54.93,20.74 54.93,19.73 54.19,18.99 44.39,18.99 43.75,18.36 43.75,16.48 51.42,8.81 65.76,8.81 71.7,2.87 92.26,2.87 94.04,4.64 99.65,4.64 X:X1.4
  Top 0.381: A:IC1.31 121.78,47.56 120.82,48.52 v100.49,48.52 | v95.53,43.55 95.53,38.57 111.34,22.75 111.34,13.59 110.58,12.83 X:X1.4
  Bottom 0.381: v95.53,43.55 v100.49,48.51 v100.49,48.52
X:N$1
  Top 0.381: X:R1.1 53.67,17.73 X:X2.8
X:VID
  Bottom 0.635: X:X1.3 103.68,13.64 X:D1.2

### Text on the board
tPlace: www.iceberg-robots.de
tNames: Iceberg Robots | Bottom | 2020 | Design by Oona